# EasyEDA Pro project ProDocument_uMSX Rev.3.78实验_2024-03-19.epro, board uMSX Rev.3.78实验
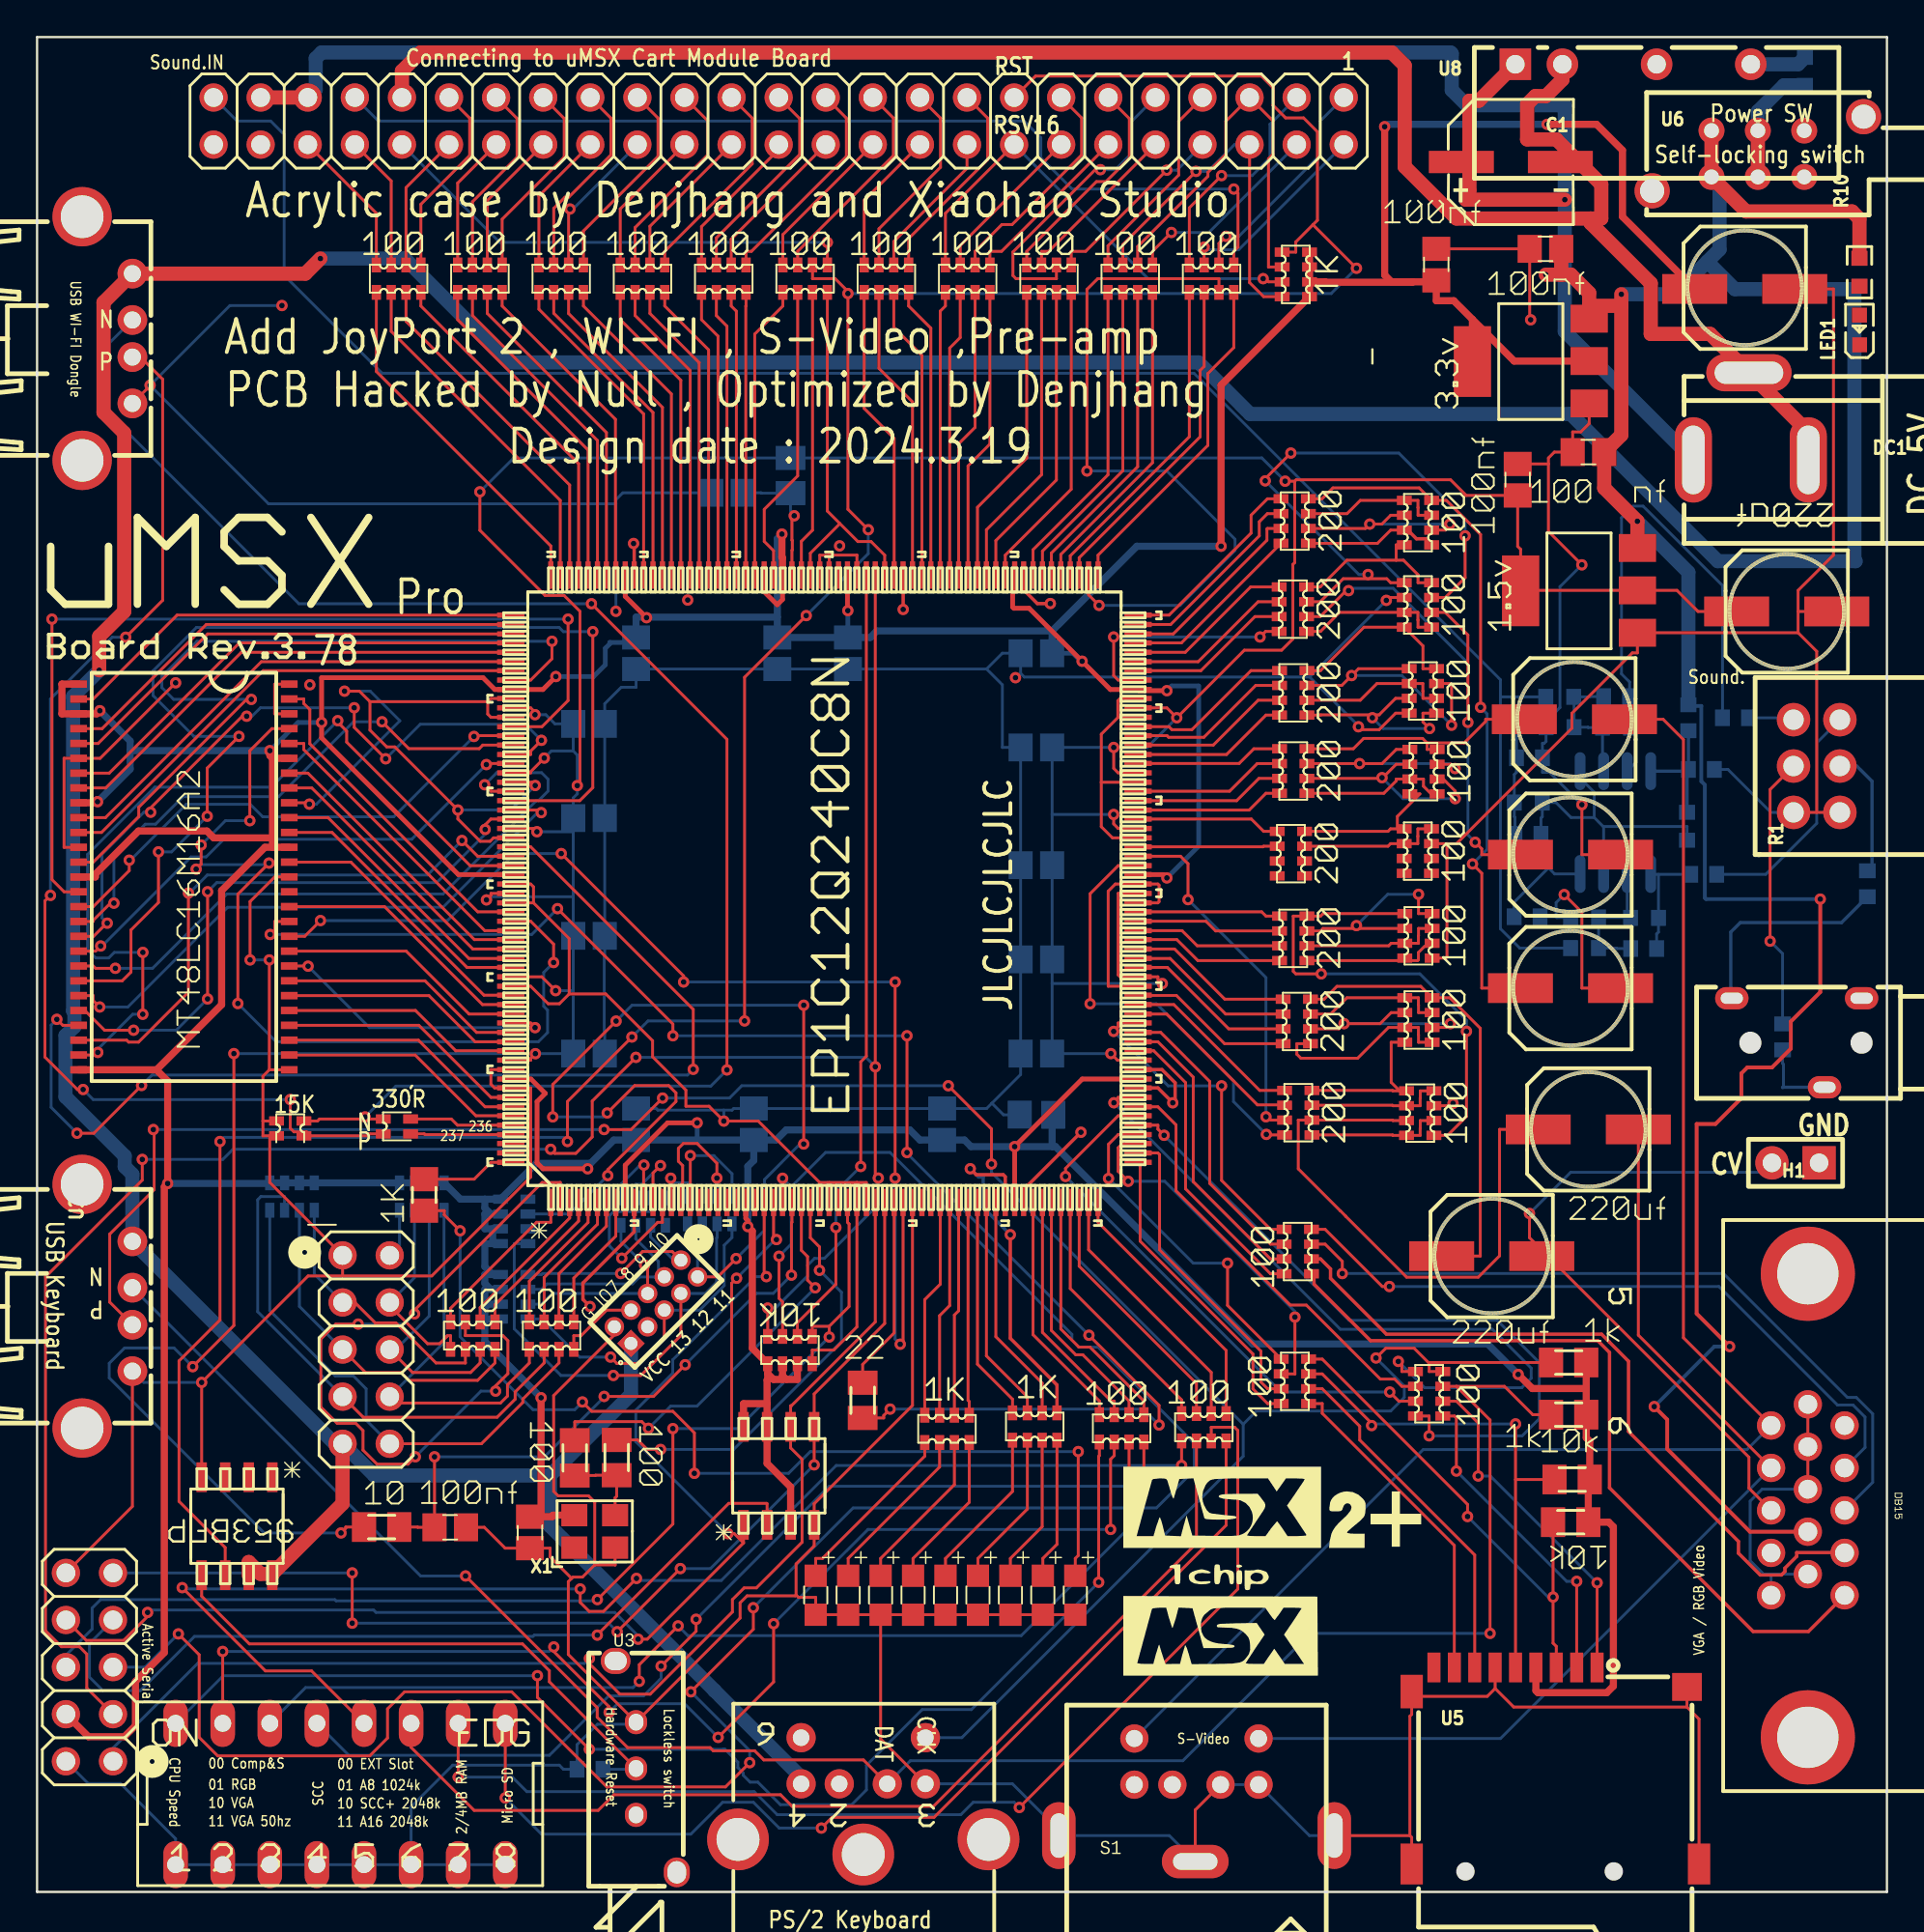
[diagram p0: board, top side]
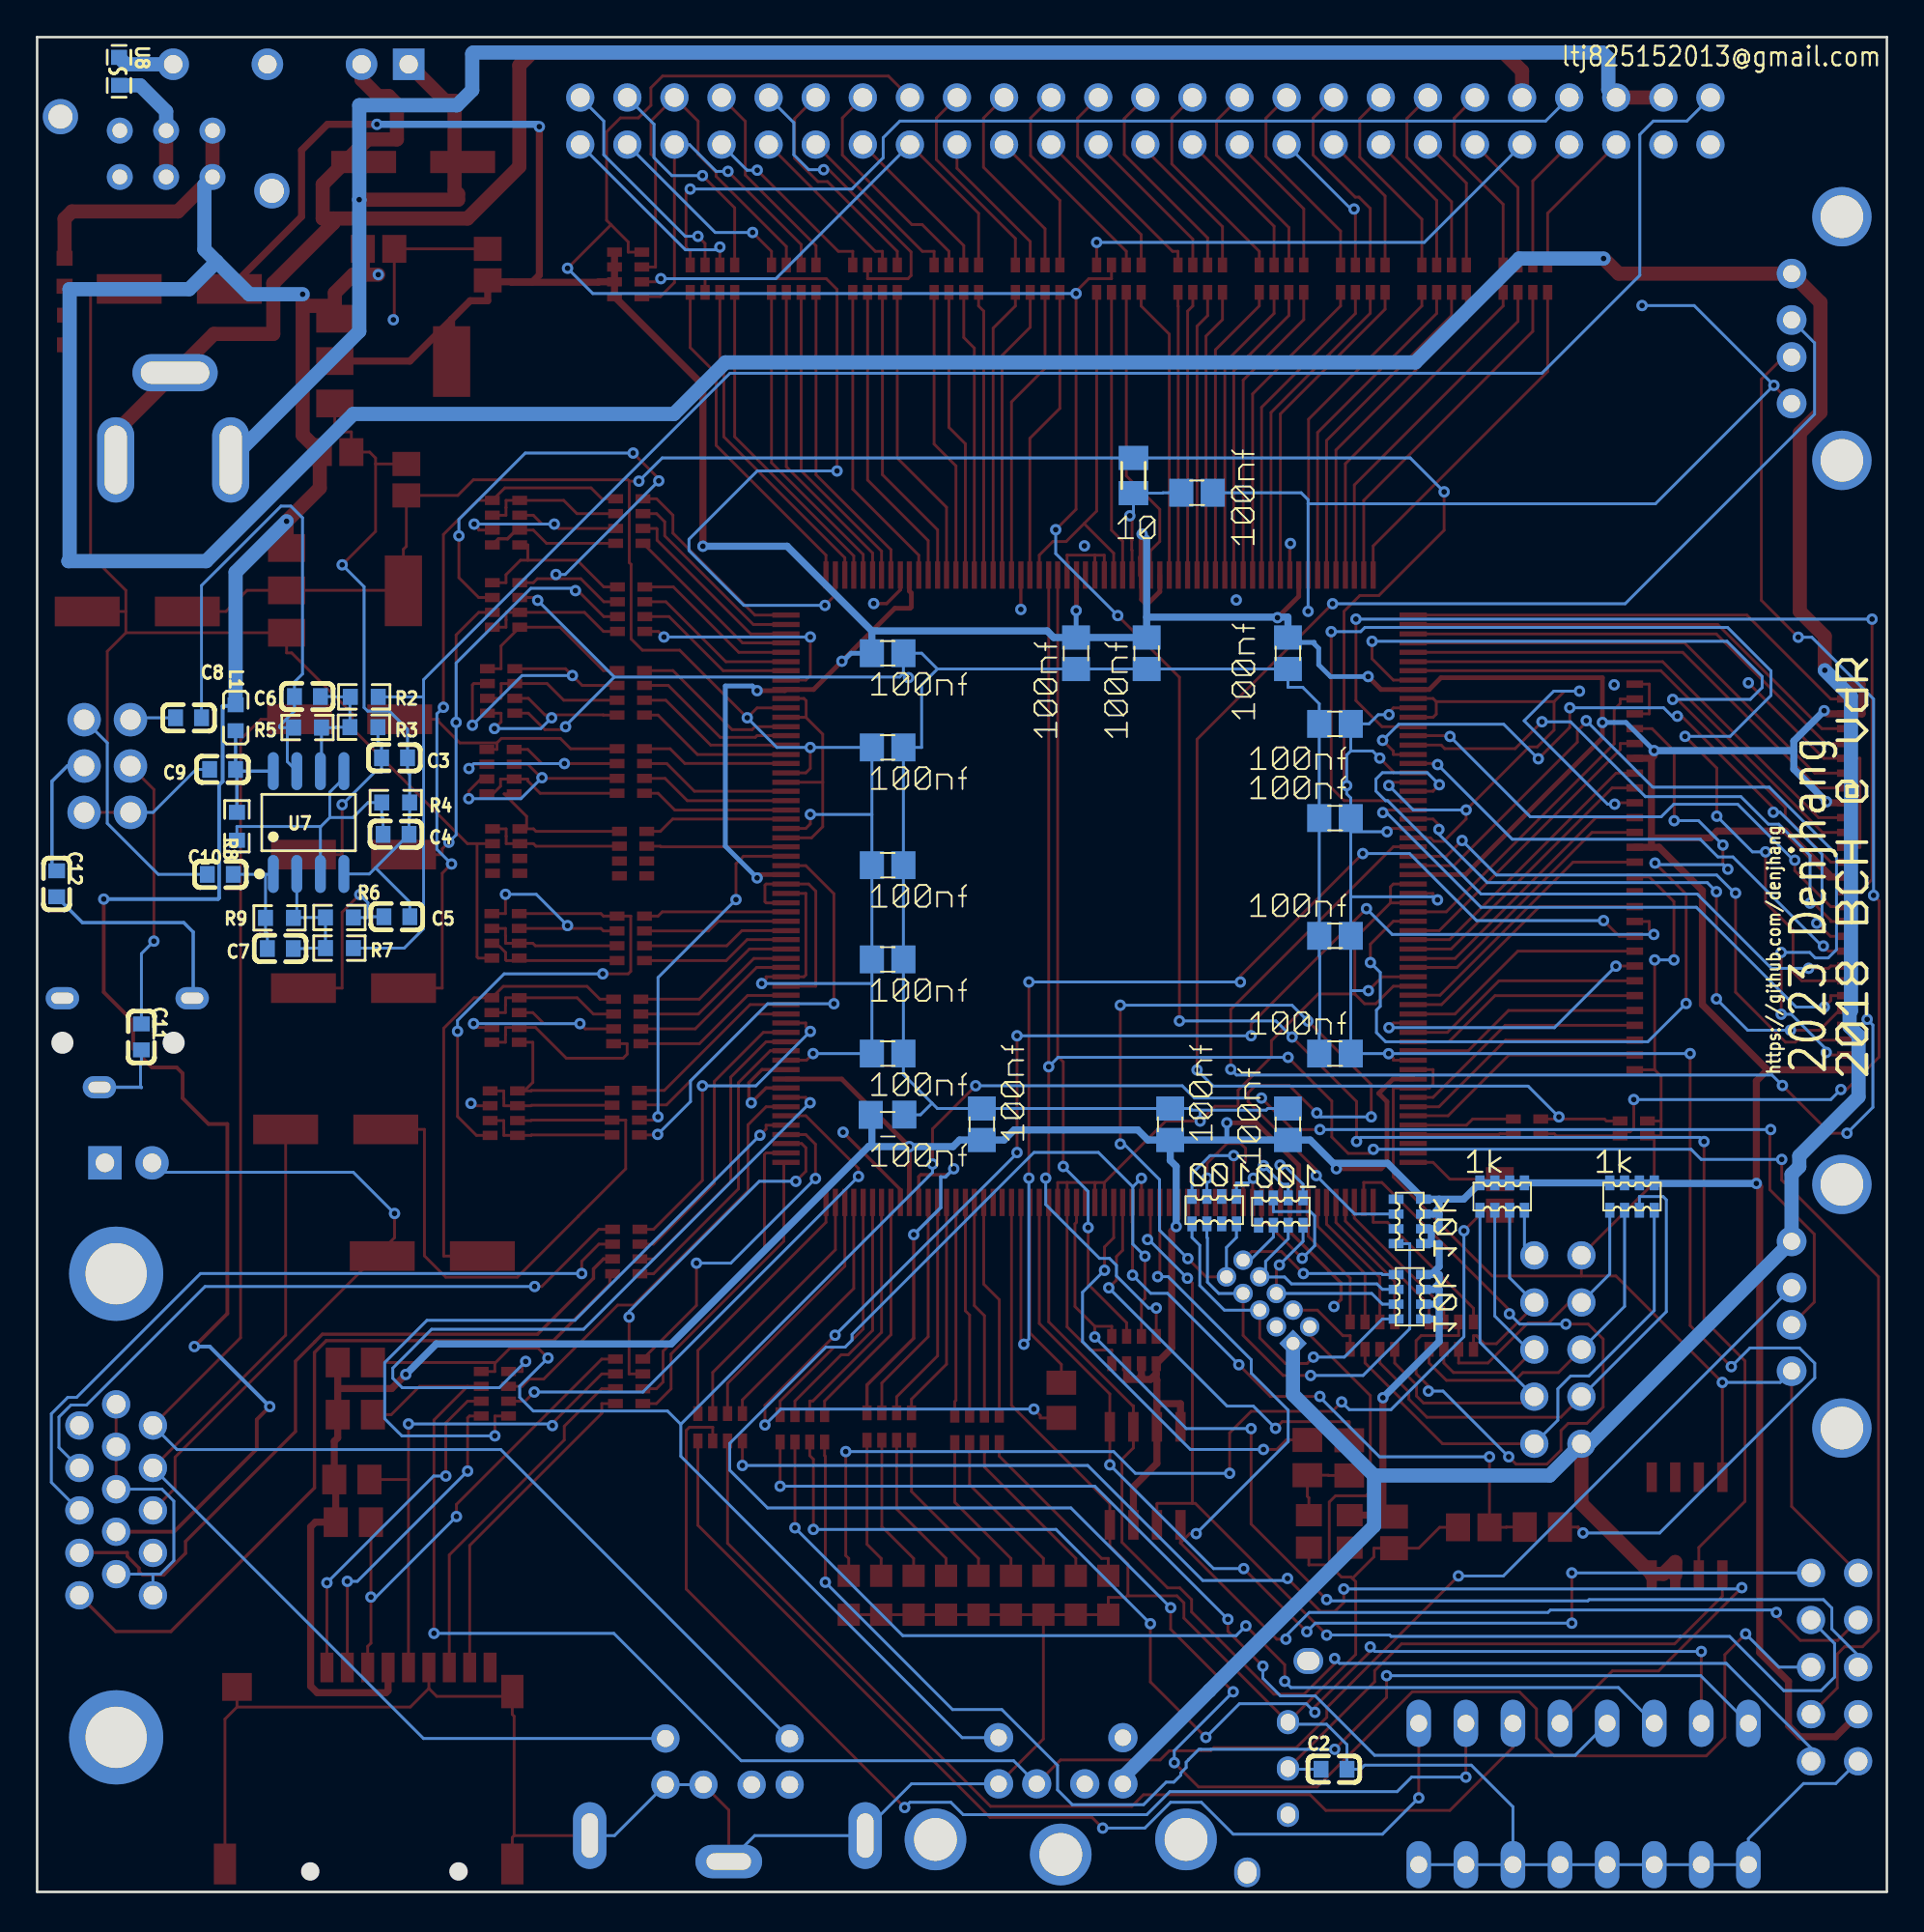
[diagram p1: board, bottom side, seen from below]

Outline 99.78 x 100.03 mm; copper layers: Top Layer, Bottom Layer. Coordinates in mm from the lower left corner of the outline.
Outline path: 0,100.03 99.78,100.03 99.78,0 0,0 0,100.03
Stack: Top Layer 0.0356mm - / Dielectric 1 0.32mm FR-4 er 4.8 / Bottom Layer 0.0356mm -

## Design rules (mm)
template: 自定义配置
spacing copperThickness1oz (default): track to track 0.127, other pairs 0.127 to 0.127
spacing copperThickness2oz: track to track 0.203, other pairs 0.152 to 0.3
track width 电源5V: min 0.203, default 0.762, max 1.016
track width copperThickness1oz (default): min 0.076, default 0.152, max 0.178
track width copperThickness2oz: min 0.203, default 0.254, max 2.54
track width 电源3V3: min 0.254, default 0.381, max 0.508
differential pair differentialPair (default): width min 0.127, default 0.254, max 2.54; gap min 0.152, default 0.152
via viaSize (default): diameter min 0.61, default 0.61, max 0.61; hole min 0.305, default 0.305, max 0.305
net $NET28 uses 电源3V3
net $NET275 uses 电源5V
net $NET279 uses 电源5V
net $NET135 uses 电源5V
net GND-IN uses 电源5V
net VCC-IN uses 电源5V

## Placement (name value [footprint] x y rotation side)
AUDIO1  PJ-320B  [AUDIO-TH_PJ-320B_C9900015649]  94.91 45.79 180 top
C1  220uF  [CAP-SMD_BD6.3-L6.6-W6.6-FD]  79.49 93.29 0 top
C2  2.2u  [C0603]  29.82 6.61 180 bottom
C3  1.5n  [C0603]  80.5 61.16 180 bottom
C4  10u  [C0603]  80.42 57.04 180 bottom
C5  1.5n  [C0603]  80.37 52.59 180 bottom
C6  120p  [C0603]  85.2 64.46 180 bottom
C7  120p  [C0603]  86.66 50.87 180 bottom
C8  4.7u  [C0603]  91.61 63.32 0 bottom
C9  100nF  [C0603]  89.77 60.53 180 bottom
C10  4.7u  [C0603]  89.9 54.87 0 bottom
C11  4.7u  [C0603]  94.15 46.11 90 bottom
C12  4.7u  [C0603]  98.72 54.37 90 bottom
DC1  DC005  [DC-IN-TH_DC005]  92.44 79.58 180 top
G IO1  HDR2X5-1.27  [HDR-TH_10P-P1.27-V-M-R2-C5-S1.27-1]  33.38 31.82 45 top
H1  HDR1X2  [HDR-TH_2P-P2.54-V-M-1]  94.85 39.32 180 top
L1  贴片磁珠0603-1/8W-70R-100MHZ(0.4R)  [L0603]  89.07 63.32 270 bottom
LED1  -  [LED_0603]  98.3 84.28 90 top
NOREF  -  [Pad_ie235]  67.21 45.74 0 top
NOREF#2  -  [Pad_ie205]  68.74 34.93 0 top
NOREF#3  -  [Pad_ie701]  31.22 71.02 0 top
NOREF#4  -  [Pad_ie2597]  26.47 33.29 90 top
NOREF#5  -  [Pad_ie395]  12.69 17.08 180 top
NOREF#6  -  [Pad_ie585]  25.55 40.84 0 top
NOREF#7  -  [Pad_ie418]  2.24 46.73 0 top
NOREF#8  -  [Pad_ie439]  2.24 63.53 0 top
NOREF#9  -  [Pad_ie422]  2.24 49.93 0 top
NOREF#10  -  [Pad_ie327]  68.37 57.19 0 top
NOREF#11  -  [Pad_ie57]  32.26 86.26 0 top
NOREF#12  -  [Pad_ie126]  61.73 24.32 0 top
NOREF#13  -  [Pad_ie100]  54.18 86.26 0 top
NOREF#14  -  [Pad_ie648]  57.23 37.18 0 top
NOREF#15  -  [Pad_e23]  10.01 1.47 0 top
NOREF#16  -  [Pad_ie614]  40.21 37.18 0 top
NOREF#17  -  [Pad_ie40]  24.28 86.26 0 top
NOREF#18  -  [Pad_ie87]  51.39 86.26 0 top
NOREF#19  -  [Pad_ie225]  67.29 41.62 0 top
NOREF#20  -  [Pad_ie187]  74.35 25.66 0 top
NOREF#21  -  [Pad_ie991]  19.02 26.71 0 top
NOREF#22  -  [Pad_ie150]  47.88 25.71 0 top
NOREF#23  -  [Pad_ie543]  25.55 61.85 0 top
NOREF#24  -  [Pad_ie310]  68.47 67.98 0 top
NOREF#25  -  [Pad_e24]  12.55 1.47 0 top
NOREF#26  -  [Pad_ie243]  68.49 50.22 0 top
NOREF#27  -  [Pad_e25]  15.09 1.47 0 top
NOREF#28  -  [Pad_ie45]  24.28 87.74 0 top
NOREF#29  -  [Pad_ie224]  67.29 42.42 0 top
NOREF#30  -  [Pad_ie415]  2.24 44.33 0 top
NOREF#31  -  [Pad_ie412]  83.72 84.84 0 top
NOREF#32  -  [Pad_ie518]  59.39 63.85 0 top
NOREF#33  -  [Pad_ie367]  80.01 55.94 0 top
NOREF#34  -  [Pad_ie2014]  35.88 37.5 0 top
NOREF#35  -  [Pad_ie338]  91.67 69.05 90 top
NOREF#36  -  [Pad_ie486]  59.39 47.85 0 top
NOREF#37  -  [Pad_ie110]  60.17 87.74 0 top
NOREF#38  -  [Pad_ie974]  37.46 94.23 0 top
NOREF#39  -  [Pad_ie621]  43.71 37.18 0 top
NOREF#40  -  [Pad_ie460]  13.6 50.73 0 top
NOREF#41  -  [Pad_ie702]  30.71 71.02 0 top
NOREF#42  -  [Pad_e10]  22.71 9.09 0 top
NOREF#43  -  [Pad_ie272]  75.49 65.17 0 top
NOREF#44  -  [Pad_e30]  25.25 1.47 0 top
NOREF#45  -  [Pad_ie932]  65.4 96.77 0 top
NOREF#46  -  [Pad_ie133]  58.1 25.74 0 top
NOREF#47  -  [Pad_ie334]  66.89 57.19 0 top
NOREF#48  -  [Pad_ie633]  49.71 37.18 0 top
NOREF#49  -  [Pad_ie230]  68.77 43.22 0 top
NOREF#50  -  [Pad_ie673]  45.21 71.02 0 top
NOREF#51  -  [Pad_ie142]  52.61 24.36 0 top
NOREF#52  -  [Pad_ie276]  74.01 64.37 0 top
NOREF#53  -  [Pad_ie678]  42.72 71.02 0 top
NOREF#54  -  [Pad_ie207]  73.77 45.82 0 top
NOREF#55  -  [Pad_ie1016]  21.15 36.76 0 top
NOREF#56  -  [Pad_ie1014]  14.95 36.76 0 top
NOREF#57  -  [Pad_ie250]  73.77 50.36 0 top
NOREF#58  -  [Pad_ie449]  13.6 59.54 0 top
NOREF#59  -  [Pad_ie425]  2.24 52.33 0 top
NOREF#60  -  [Pad_ie2468]  26.47 37.36 90 top
NOREF#61  -  [Pad_ie2596]  26.47 31.7 90 top
NOREF#62  -  [Pad_ie149]  48.68 25.71 0 top
NOREF#63  -  [Pad_ie1047]  30.62 45.21 0 top
NOREF#64  -  [Pad_ie577]  25.55 44.85 0 top
NOREF#65  -  [Pad_ie658]  52.73 71.02 0 top
NOREF#66  -  [Pad_ie612]  39.22 37.18 0 top
NOREF#67  -  [Pad_ie454]  13.6 55.53 0 top
NOREF#68  -  [Pad_ie669]  47.22 71.02 0 top
NOREF#69  -  [Pad_ie987]  19.02 31.79 0 top
NOREF#70  -  [Pad_ie358]  83.56 25.74 0 top
NOREF#71  -  [Pad_ie114]  64.55 87.74 0 top
NOREF#72  -  [Pad_ie94]  51.39 87.74 0 top
NOREF#73  -  [Pad_ie1224]  95.51 24 180 top
NOREF#74  -  [Pad_ie257]  75.21 55.73 0 top
NOREF#75  -  [Pad_ie941]  40 94.23 0 top
NOREF#76  -  [Pad_ie631]  48.72 37.18 0 top
NOREF#77  -  [Pad_ie19]  52.5 14.95 0 top
NOREF#78  -  [Pad_ie49]  27.87 87.74 0 top
NOREF#79  -  [Pad_ie575]  25.55 45.84 0 top
NOREF#80  -  [Pad_ie82]  44.61 87.74 0 top
NOREF#81  -  [Pad_ie216]  75.34 42.4 0 top
NOREF#82  -  [Pad_ie410]  86.32 70.19 0 top
NOREF#83  -  [Pad_ie1037]  54.75 61.72 0 top
NOREF#84  -  [Pad_ie359]  83.56 28.55 0 top
NOREF#85  -  [Pad_ie162]  24.7 30.74 0 top
NOREF#86  -  [Pad_ie471]  59.39 40.36 0 top
NOREF#87  -  [Pad_ie437]  2.24 61.93 0 top
NOREF#88  -  [Pad_ie356]  81.85 22.24 0 top
NOREF#89  -  [Pad_ie474]  59.39 41.86 0 top
NOREF#90  -  [Pad_ie1027]  32.31 40.55 0 top
NOREF#91  -  [Pad_ie1010]  12.55 38.24 0 top
NOREF#92  -  [Pad_ie166]  22.3 29.26 0 top
NOREF#93  -  [Pad_ie291]  73.75 75.04 0 top
NOREF#94  -  [Pad_ie546]  25.55 60.35 0 top
NOREF#95  -  [Pad_ie950]  40 96.77 0 top
NOREF#96  -  [Pad_ie2467]  26.47 35.76 90 top
NOREF#97  -  [Pad_ie220]  73.87 41.6 0 top
NOREF#98  -  [Pad_ie698]  32.71 71.02 0 top
NOREF#99  -  [Pad_ie650]  56.72 71.02 0 top
NOREF#100  -  [Pad_ie983]  4.09 14.66 270 top
NOREF#101  -  [Pad_ie538]  25.55 64.36 0 top
NOREF#102  -  [Pad_e11]  25.25 9.09 0 top
NOREF#103  -  [Pad_ie934]  67.94 94.23 0 top
NOREF#104  -  [Pad_ie81]  45.41 87.74 0 top
NOREF#105  -  [Pad_ie1056]  38.06 75.45 0 top
NOREF#106  -  [Pad_ie44]  23.48 87.74 0 top
NOREF#107  -  [Pad_ie4281]  21.44 19.66 90 top
NOREF#108  -  [Pad_ie155]  28.95 30.74 0 top
NOREF#109  -  [Pad_ie46]  25.08 87.74 0 top
NOREF#110  -  [Pad_ie566]  25.55 50.34 0 top
NOREF#111  -  [Pad_ie630]  48.21 37.18 0 top
NOREF#112  -  [Pad_ie37]  19.9 86.26 0 top
NOREF#113  -  [Pad_ie99]  53.38 86.26 0 top
NOREF#114  -  [Pad_ie436]  2.24 61.13 0 top
NOREF#115  -  [Pad_ie122]  64.14 25.8 0 top
NOREF#116  -  [Pad_ie287]  75.22 72.64 0 top
NOREF#117  -  [Pad_ie558]  25.55 54.35 0 top
NOREF#118  -  [Pad_ie1034]  43.74 67.65 0 top
NOREF#119  -  [Pad_ie459]  13.6 51.53 0 top
NOREF#120  -  [Pad_ie469]  59.39 39.34 0 top
NOREF#121  -  [Pad_ie685]  39.22 71.02 0 top
NOREF#122  -  [Pad_ie1252]  97.5 16 180 top
NOREF#123  -  [Pad_ie4245]  19.53 19.68 270 top
NOREF#124  -  [Pad_ie1025]  38.66 42.25 0 top
NOREF#125  -  [Pad_ie489]  59.39 49.35 0 top
NOREF#126  -  [Pad_ie42]  22.68 86.26 0 top
NOREF#127  -  [Pad_ie28]  45.5 17.05 0 top
NOREF#128  -  [Pad_ie2569]  25 36.56 90 top
NOREF#129  -  [Pad_ie129]  58.9 24.26 0 top
NOREF#130  -  [Pad_ie1039]  53.05 55.37 0 top
NOREF#131  -  [Pad_ie2670]  25 31.7 90 top
NOREF#132  -  [Pad_ie1963]  35.08 36.03 0 top
NOREF#133  -  [Pad_ie1983]  36.68 36.03 0 top
NOREF#134  -  [Pad_ie248]  73.77 51.96 0 top
NOREF#135  -  [Pad_ie32]  19.9 87.74 0 top
NOREF#136  -  [Pad_ie506]  59.39 57.86 0 top
NOREF#137  -  [Pad_ie652]  55.73 71.02 0 top
NOREF#138  -  [Pad_ie948]  45.08 96.77 0 top
NOREF#139  -  [Pad_ie556]  25.55 55.34 0 top
NOREF#140  -  [Pad_ie213]  75.25 46.62 0 top
NOREF#141  -  [Pad_ie430]  2.24 56.33 0 top
NOREF#142  -  [Pad_ie4273]  23.14 19.66 90 top
NOREF#143  -  [Pad_ie969]  24.76 94.23 0 top
NOREF#144  -  [Pad_e9]  20.17 9.09 0 top
NOREF#145  -  [Pad_ie3056]  20.15 41.68 90 top
NOREF#146  -  [Pad_ie1026]  38.66 40.55 0 top
NOREF#147  -  [Pad_ie509]  59.39 59.36 0 top
NOREF#148  -  [Pad_ie487]  59.39 48.36 0 top
NOREF#149  -  [Pad_ie1834]  31.49 35.95 0 top
NOREF#150  -  [Pad_ie988]  16.48 31.79 0 top
NOREF#151  -  [Pad_ie535]  25.55 65.86 0 top
NOREF#152  -  [Pad_e27]  20.17 1.47 0 top
NOREF#153  -  [Pad_ie31]  20.7 87.74 0 top
NOREF#154  -  [Pad_ie955]  27.3 96.77 0 top
NOREF#155  -  [Pad_ie693]  35.23 71.02 0 top
NOREF#156  -  [Pad_ie427]  2.24 53.93 0 top
NOREF#157  -  [Pad_ie48]  28.67 87.74 0 top
NOREF#158  -  [Pad_ie583]  25.55 41.86 0 top
NOREF#159  -  [Pad_ie2490]  26.47 34.96 90 top
NOREF#160  -  [Pad_ie589]  27.71 37.18 0 top
NOREF#161  -  [Pad_ie977]  1.55 12.12 270 top
NOREF#162  -  [Pad_ie279]  73.74 70.6 0 top
NOREF#163  -  [Pad_ie204]  68.74 34.14 0 top
NOREF#164  -  [Pad_ie58]  31.45 86.26 0 top
NOREF#165  -  [Pad_ie998]  41.21 8.32 270 top
NOREF#166  -  [Pad_ie2595]  26.47 32.49 90 top
NOREF#167  -  [Pad_ie692]  35.71 71.02 0 top
NOREF#168  -  [Pad_ie76]  41.03 87.74 0 top
NOREF#169  -  [Pad_ie170]  68.63 88.43 0 top
NOREF#170  -  [Pad_ie368]  85.41 55.94 0 top
NOREF#171  -  [Pad_ie552]  25.55 57.35 0 top
NOREF#172  -  [Pad_ie495]  59.39 52.35 0 top
NOREF#173  -  [Pad_ie294]  73.75 72.64 0 top
NOREF#174  -  [Pad_ie967]  19.68 94.23 0 top
NOREF#175  -  [Pad_ie2521]  25 34.96 90 top
NOREF#176  -  [Pad_ie392]  10.15 22.36 180 top
NOREF#177  -  [Pad_ie426]  2.24 53.13 0 top
NOREF#178  -  [Pad_ie435]  2.24 60.33 0 top
NOREF#179  -  [Pad_ie260]  73.74 55.73 0 top
NOREF#180  -  [Pad_ie1012]  13.35 36.76 0 top
NOREF#181  -  [Pad_ie996]  44.56 2.02 270 top
NOREF#182  -  [Pad_ie1052]  28.92 57.91 0 top
NOREF#183  -  [Pad_ie305]  67 69.58 0 top
NOREF#184  -  [Pad_ie503]  59.39 56.36 0 top
NOREF#185  -  [Pad_ie564]  25.55 51.36 0 top
NOREF#186  -  [Pad_ie2518]  25 37.36 90 top
NOREF#187  -  [Pad_ie1220]  97.5 25.15 270 top
NOREF#188  -  [Pad_ie4207]  26.59 18.54 0 top
NOREF#189  -  [Pad_ie649]  57.23 71.02 0 top
NOREF#190  -  [Pad_ie282]  73.74 68.2 0 top
NOREF#191  -  [Pad_ie574]  25.55 46.35 0 top
NOREF#192  -  [Pad_ie236]  67.21 46.54 0 top
NOREF#193  -  [Pad_ie937]  60.32 94.23 0 top
NOREF#194  -  [Pad_ie15]  45.5 14.95 0 top
NOREF#195  -  [Pad_ie953]  32.38 96.77 0 top
NOREF#196  -  [Pad_ie507]  59.39 58.34 0 top
NOREF#197  -  [Pad_ie245]  68.49 51.82 0 top
NOREF#198  -  [Pad_ie102]  55.78 86.26 0 top
NOREF#199  -  [Pad_ie47]  29.47 87.74 0 top
NOREF#200  -  [Pad_ie940]  52.7 94.23 0 top
NOREF#201  -  [Pad_ie78]  42.63 87.74 0 top
NOREF#202  -  [Pad_ie467]  13.6 45.13 0 top
NOREF#203  -  [Pad_ie500]  59.39 54.86 0 top
NOREF#204  -  [Pad_ie271]  75.49 65.96 0 top
NOREF#205  -  [Pad_ie309]  68.47 68.78 0 top
NOREF#206  -  [Pad_ie228]  68.77 41.62 0 top
NOREF#207  -  [Pad_ie20]  54.25 14.95 0 top
NOREF#208  -  [Pad_ie615]  40.72 37.18 0 top
NOREF#209  -  [Pad_ie609]  37.72 37.18 0 top
NOREF#210  -  [Pad_ie601]  33.73 37.18 0 top
NOREF#211  -  [Pad_ie407]  77.42 82.53 0 top
NOREF#212  -  [Pad_ie440]  2.24 64.33 0 top
NOREF#213  -  [Pad_ie431]  2.24 57.13 0 top
NOREF#214  -  [Pad_ie947]  47.62 96.77 0 top
NOREF#215  -  [Pad_ie972]  32.38 94.23 0 top
NOREF#216  -  [Pad_ie1854]  33.09 35.95 0 top
NOREF#217  -  [Pad_ie229]  68.77 42.42 0 top
NOREF#218  -  [Pad_ie961]  12.06 96.77 0 top
NOREF#219  -  [Pad_ie340]  89.41 86.45 90 top
NOREF#220  -  [Pad_ie942]  42.54 94.23 0 top
NOREF#221  -  [Pad_ie562]  25.55 52.35 0 top
NOREF#222  -  [Pad_ie450]  13.6 58.74 0 top
NOREF#223  -  [Pad_ie269]  75.52 60.81 0 top
NOREF#224  -  [Pad_ie532]  25.55 67.36 0 top
NOREF#225  -  [Pad_ie511]  59.39 60.35 0 top
NOREF#226  -  [Pad_ie132]  58.9 25.74 0 top
NOREF#227  -  [Pad_ie69]  37.44 86.26 0 top
NOREF#228  -  [Pad_ie1042]  53.05 50.29 0 top
NOREF#229  -  [Pad_ie613]  39.73 37.18 0 top
NOREF#230  -  [Pad_ie572]  25.55 47.34 0 top
NOREF#231  -  [Pad_ie550]  25.55 58.34 0 top
NOREF#232  -  [Pad_ie283]  75.22 68.2 0 top
NOREF#233  -  [Pad_ie660]  51.71 71.02 0 top
NOREF#234  -  [Pad_ie1041]  54.75 50.29 0 top
NOREF#235  -  [Pad_ie193]  68.58 27.13 0 top
NOREF#236  -  [Pad_ie600]  33.22 37.18 0 top
NOREF#237  -  [Pad_ie1038]  53.05 61.72 0 top
NOREF#238  -  [Pad_ie371]  75.47 88.61 0 top
NOREF#239  -  [Pad_ie112]  62.95 87.74 0 top
NOREF#240  -  [Pad_ie651]  56.21 71.02 0 top
NOREF#241  -  [Pad_ie482]  59.39 45.84 0 top
NOREF#242  -  [Pad_ie473]  59.39 41.35 0 top
NOREF#243  -  [Pad_ie981]  4.09 9.58 270 top
NOREF#244  -  [Pad_ie417]  2.24 45.93 0 top
NOREF#245  -  [Pad_ie479]  59.39 44.35 0 top
NOREF#246  -  [Pad_ie323]  68.49 61.65 0 top
NOREF#247  -  [Pad_ie1162]  93.53 20.58 180 top
NOREF#248  -  [Pad_ie706]  28.73 71.02 0 top
NOREF#249  -  [Pad_ie1024]  48.82 42.25 0 top
NOREF#250  -  [Pad_ie623]  44.73 37.18 0 top
NOREF#251  -  [Pad_ie125]  62.53 24.32 0 top
NOREF#252  -  [Pad_ie512]  59.39 60.86 0 top
NOREF#253  -  [Pad_ie13]  42 14.95 0 top
NOREF#254  -  [Pad_ie949]  42.54 96.77 0 top
NOREF#255  -  [Pad_ie292]  73.75 74.24 0 top
NOREF#256  -  [Pad_ie595]  30.71 37.18 0 top
NOREF#257  -  [Pad_ie38]  20.7 86.26 0 top
NOREF#258  -  [Pad_ie101]  54.98 86.26 0 top
NOREF#259  -  [Pad_ie232]  68.68 47.34 0 top
NOREF#260  -  [Pad_ie161]  23.9 30.74 0 top
NOREF#261  -  [Pad_ie152]  27.35 29.26 0 top
NOREF#262  -  [Pad_ie1011]  12.55 36.76 0 top
NOREF#263  -  [Pad_ie536]  25.55 65.35 0 top
NOREF#264  -  [Pad_ie464]  13.6 47.53 0 top
NOREF#265  -  [Pad_ie59]  31.45 87.74 0 top
NOREF#266  -  [Pad_ie344]  82.21 88.61 0 top
NOREF#267  -  [Pad_ie141]  53.41 24.36 0 top
NOREF#268  -  [Pad_ie369]  85.62 63.24 0 top
NOREF#269  -  [Pad_ie3133]  12.92 40.78 90 top
NOREF#270  -  [Pad_ie1022]  21.95 38.24 0 top
NOREF#271  -  [Pad_ie108]  58.56 87.74 0 top
NOREF#272  -  [Pad_ie432]  2.24 57.93 0 top
NOREF#273  -  [Pad_ie317]  67.02 64.26 0 top
NOREF#274  -  [Pad_e8]  17.63 9.09 0 top
NOREF#275  -  [Pad_ie307]  68.47 70.38 0 top
NOREF#276  -  [Pad_ie227]  68.77 40.82 0 top
NOREF#277  -  [Pad_ie980]  4.09 7.04 270 top
NOREF#278  -  [Pad_ie529]  25.55 68.86 0 top
NOREF#279  -  [Pad_ie364]  86.37 41.12 0 top
NOREF#280  -  [Pad_ie251]  75.25 50.36 0 top
NOREF#281  -  [Pad_ie667]  48.21 71.02 0 top
NOREF#282  -  [Pad_ie544]  25.55 61.34 0 top
NOREF#283  -  [Pad_ie107]  57.76 87.74 0 top
NOREF#284  -  [Pad_ie448]  13.6 60.33 0 top
NOREF#285  -  [Pad_ie255]  75.21 57.33 0 top
NOREF#286  -  [Pad_ie63]  38.24 87.74 0 top
NOREF#287  -  [Pad_ie534]  25.55 66.34 0 top
NOREF#288  -  [Pad_ie214]  75.25 45.82 0 top
NOREF#289  -  [Pad_ie524]  59.39 66.85 0 top
NOREF#290  -  [Pad_ie247]  73.77 52.76 0 top
NOREF#291  -  [Pad_ie39]  25.08 86.26 0 top
NOREF#292  -  [Pad_ie1159]  95.51 8.34 180 top
NOREF#293  -  [Pad_ie157]  27.35 30.74 0 top
NOREF#294  -  [Pad_ie646]  56.21 37.18 0 top
NOREF#295  -  [Pad_ie4204]  31.26 24.37 180 top
NOREF#296  -  [Pad_ie249]  73.77 51.16 0 top
NOREF#297  -  [Pad_ie365]  85.41 48.74 0 top
NOREF#298  -  [Pad_ie2619]  26.47 30.9 90 top
NOREF#299  -  [Pad_ie671]  46.23 71.02 0 top
NOREF#300  -  [Pad_ie153]  28.15 29.26 0 top
NOREF#301  -  [Pad_ie264]  74.04 60.81 0 top
NOREF#302  -  [Pad_ie656]  53.72 71.02 0 top
NOREF#303  -  [Pad_ie83]  44.61 86.26 0 top
NOREF#304  -  [Pad_ie1021]  21.15 38.24 0 top
NOREF#305  -  [Pad_ie156]  28.15 30.74 0 top
NOREF#306  -  [Pad_ie109]  59.36 87.74 0 top
NOREF#307  -  [Pad_ie280]  73.74 69.8 0 top
NOREF#308  -  [Pad_ie604]  35.23 37.18 0 top
NOREF#309  -  [Pad_ie295]  68.57 72.73 0 top
NOREF#310  -  [Pad_ie438]  2.24 62.73 0 top
NOREF#311  -  [Pad_ie1223]  93.53 22.87 180 top
NOREF#312  -  [Pad_ie244]  68.49 51.02 0 top
NOREF#313  -  [Pad_ie492]  59.39 50.85 0 top
NOREF#314  -  [Pad_ie221]  73.87 42.4 0 top
NOREF#315  -  [Pad_ie198]  67.11 28.74 0 top
NOREF#316  -  [Pad_ie191]  68.58 28.74 0 top
NOREF#317  -  [Pad_ie267]  75.52 59.22 0 top
NOREF#318  -  [Pad_ie519]  59.39 64.36 0 top
NOREF#319  -  [Pad_ie179]  41.81 29.96 90 top
NOREF#320  -  [Pad_ie268]  75.52 60.02 0 top
NOREF#321  -  [Pad_ie946]  50.16 96.77 0 top
NOREF#322  -  [Pad_ie603]  34.72 37.18 0 top
NOREF#323  -  [Pad_ie959]  17.14 96.77 0 top
NOREF#324  -  [Pad_ie411]  86.32 72.48 0 top
NOREF#325  -  [Pad_ie333]  66.89 56.39 0 top
NOREF#326  -  [Pad_ie331]  66.89 54.79 0 top
NOREF#327  -  [Pad_ie346]  82.83 77.65 0 top
NOREF#328  -  [Pad_ie682]  40.72 71.02 0 top
NOREF#329  -  [Pad_ie579]  25.55 43.84 0 top
NOREF#330  -  [Pad_ie290]  75.22 75.04 0 top
NOREF#331  -  [Pad_ie120]  62.53 25.8 0 top
NOREF#332  -  [Pad_ie936]  62.86 94.23 0 top
NOREF#333  -  [Pad_ie70]  38.24 86.26 0 top
NOREF#334  -  [Pad_ie455]  13.6 54.73 0 top
NOREF#335  -  [Pad_ie201]  67.26 34.14 0 top
NOREF#336  -  [Pad_ie239]  67.02 52.62 0 top
NOREF#337  -  [Pad_ie956]  24.76 96.77 0 top
NOREF#338  -  [Pad_ie605]  35.71 37.18 0 top
NOREF#339  -  [Pad_ie315]  67.02 65.86 0 top
NOREF#340  -  [Pad_ie177]  41.01 28.48 90 top
NOREF#341  -  [Pad_ie53]  28.67 86.26 0 top
NOREF#342  -  [Pad_ie159]  22.3 30.74 0 top
NOREF#343  -  [Pad_ie510]  59.39 59.84 0 top
NOREF#344  -  [Pad_ie396]  11.42 17.08 180 top
NOREF#345  -  [Pad_ie1225]  93.53 25.15 180 top
NOREF#346  -  [Pad_ie211]  75.25 48.22 0 top
NOREF#347  -  [Pad_ie571]  25.55 47.85 0 top
NOREF#348  -  [Pad_ie231]  68.68 48.14 0 top
NOREF#349  -  [Pad_ie680]  41.71 71.02 0 top
NOREF#350  -  [Pad_ie568]  25.55 49.35 0 top
NOREF#351  -  [Pad_ie586]  25.55 40.36 0 top
NOREF#352  -  [Pad_ie602]  34.21 37.18 0 top
NOREF#353  -  [Pad_ie428]  2.24 54.73 0 top
NOREF#354  -  [Pad_ie608]  37.21 37.18 0 top
NOREF#355  -  [Pad_ie393]  11.42 22.36 180 top
NOREF#356  -  [Pad_ie74]  40.23 86.26 0 top
NOREF#357  -  [Pad_ie697]  33.22 71.02 0 top
NOREF#358  -  [Pad_ie640]  53.21 37.18 0 top
NOREF#359  -  [Pad_ie304]  67 68.78 0 top
NOREF#360  -  [Pad_ie91]  48.99 87.74 0 top
NOREF#361  -  [Pad_ie644]  55.22 37.18 0 top
NOREF#362  -  [Pad_ie339]  94.81 86.45 90 top
NOREF#363  -  [Pad_e7]  15.09 9.09 0 top
NOREF#364  -  [Pad_ie530]  25.55 68.35 0 top
NOREF#365  -  [Pad_ie4208]  26.59 20.24 0 top
NOREF#366  -  [Pad_ie965]  14.6 94.23 0 top
NOREF#367  -  [Pad_ie441]  2.24 65.13 0 top
NOREF#368  -  [Pad_ie481]  59.39 45.36 0 top
NOREF#369  -  [Pad_ie68]  36.64 86.26 0 top
NOREF#370  -  [Pad_ie84]  45.41 86.26 0 top
NOREF#371  -  [Pad_ie2698]  25 32.49 90 top
NOREF#372  -  [Pad_ie1040]  54.75 55.37 0 top
NOREF#373  -  [Pad_ie979]  1.55 7.04 270 top
NOREF#374  -  [Pad_ie151]  26.55 29.26 0 top
NOREF#375  -  [Pad_ie634]  50.22 37.18 0 top
NOREF#376  -  [Pad_ie523]  59.39 66.34 0 top
NOREF#377  -  [Pad_ie398]  8.88 17.08 180 top
NOREF#378  -  [Pad_ie637]  51.71 37.18 0 top
NOREF#379  -  [Pad_ie596]  31.22 37.18 0 top
NOREF#380  -  [Pad_ie390]  44.53 25.56 0 top
NOREF#381  -  [Pad_ie1051]  30.62 57.91 0 top
NOREF#382  -  [Pad_ie635]  50.72 37.18 0 top
NOREF#383  -  [Pad_ie528]  59.39 68.86 0 top
NOREF#384  -  [Pad_ie420]  2.24 48.33 0 top
NOREF#385  -  [Pad_ie1020]  20.35 38.24 0 top
NOREF#386  -  [Pad_ie1253]  93.53 16 180 top
NOREF#387  -  [Pad_ie968]  22.22 94.23 0 top
NOREF#388  -  [Pad_ie462]  13.6 49.13 0 top
NOREF#389  -  [Pad_ie1045]  54.75 45.21 0 top
NOREF#390  -  [Pad_ie1255]  93.53 18.28 180 top
NOREF#391  -  [Pad_ie144]  48.68 24.23 0 top
NOREF#392  -  [Pad_ie196]  67.11 27.13 0 top
NOREF#393  -  [Pad_ie124]  63.33 24.32 0 top
NOREF#394  -  [Pad_ie957]  22.22 96.77 0 top
NOREF#395  -  [Pad_ie1007]  14.95 38.24 0 top
NOREF#396  -  [Pad_ie699]  32.21 71.02 0 top
NOREF#397  -  [Pad_ie22]  56 17.05 0 top
NOREF#398  -  [Pad_ie240]  67.02 51.82 0 top
NOREF#399  -  [Pad_ie501]  59.39 55.34 0 top
NOREF#400  -  [Pad_ie951]  37.46 96.77 0 top
NOREF#401  -  [Pad_ie559]  25.55 53.85 0 top
NOREF#402  -  [Pad_ie938]  57.78 94.23 0 top
NOREF#403  -  [Pad_ie286]  75.22 70.6 0 top
NOREF#404  -  [Pad_ie684]  39.73 71.02 0 top
NOREF#405  -  [Pad_ie445]  13.6 62.73 0 top
NOREF#406  -  [Pad_ie167]  68.63 86.03 0 top
NOREF#407  -  [Pad_ie499]  59.39 54.35 0 top
NOREF#408  -  [Pad_ie670]  46.71 71.02 0 top
NOREF#409  -  [Pad_ie414]  83.72 80.27 0 top
NOREF#410  -  [Pad_ie3132]  12.92 41.58 90 top
NOREF#411  -  [Pad_ie1058]  40.64 75.43 0 top
NOREF#412  -  [Pad_ie993]  16.48 24.17 0 top
NOREF#413  -  [Pad_ie672]  45.72 71.02 0 top
NOREF#414  -  [Pad_ie975]  1.55 17.2 270 top
NOREF#415  -  [Pad_ie176]  40.21 28.48 90 top
NOREF#416  -  [Pad_ie318]  67.02 63.46 0 top
NOREF#417  -  [Pad_e29]  22.71 1.47 0 top
NOREF#418  -  [Pad_ie491]  59.39 50.34 0 top
NOREF#419  -  [Pad_ie514]  59.39 61.85 0 top
NOREF#420  -  [Pad_ie27]  47.25 17.05 0 top
NOREF#421  -  [Pad_ie357]  81.66 25.74 0 top
NOREF#422  -  [Pad_ie409]  86.32 67.9 0 top
NOREF#423  -  [Pad_ie189]  74.35 27.26 0 top
NOREF#424  -  [Pad_ie25]  50.75 17.05 0 top
NOREF#425  -  [Pad_ie104]  59.36 86.26 0 top
NOREF#426  -  [Pad_ie254]  75.25 52.76 0 top
NOREF#427  -  [Pad_ie4240]  17.64 19.68 270 top
NOREF#428  -  [Pad_ie72]  41.83 86.26 0 top
NOREF#429  -  [Pad_ie1023]  48.82 40.55 0 top
NOREF#430  -  [Pad_ie3063]  18.67 41.68 90 top
NOREF#431  -  [Pad_ie554]  25.55 56.36 0 top
NOREF#432  -  [Pad_ie581]  25.55 42.85 0 top
NOREF#433  -  [Pad_ie643]  54.71 37.18 0 top
NOREF#434  -  [Pad_ie140]  54.21 24.36 0 top
NOREF#435  -  [Pad_ie1003]  45.86 5.83 270 top
NOREF#436  -  [Pad_ie361]  75.76 34.29 0 top
NOREF#437  -  [Pad_ie209]  73.77 47.42 0 top
NOREF#438  -  [Pad_ie147]  50.28 25.71 0 top
NOREF#439  -  [Pad_ie299]  67.1 75.13 0 top
NOREF#440  -  [Pad_ie990]  19.02 29.25 0 top
NOREF#441  -  [Pad_ie1219]  95.51 26.3 180 top
NOREF#442  -  [Pad_ie226]  67.29 40.82 0 top
NOREF#443  -  [Pad_ie645]  55.73 37.18 0 top
NOREF#444  -  [Pad_ie293]  73.75 73.44 0 top
NOREF#445  -  [Pad_ie377]  20.88 38.44 0 top
NOREF#446  -  [Pad_ie233]  68.68 46.54 0 top
NOREF#447  -  [Pad_ie192]  68.58 27.94 0 top
NOREF#448  -  [Pad_ie311]  68.49 63.46 0 top
NOREF#449  -  [Pad_ie242]  67.02 50.22 0 top
NOREF#450  -  [Pad_ie933]  67.94 96.77 0 top
NOREF#451  -  [Pad_ie517]  59.39 63.35 0 top
NOREF#452  -  [Pad_ie116]  63.75 86.26 0 top
NOREF#453  -  [Pad_ie423]  2.24 50.73 0 top
NOREF#454  -  [Pad_ie2541]  25 35.76 90 top
NOREF#455  -  [Pad_ie687]  38.23 71.02 0 top
NOREF#456  -  [Pad_ie691]  36.22 71.02 0 top
NOREF#457  -  [Pad_ie496]  59.39 52.85 0 top
NOREF#458  -  [Pad_ie1256]  95.51 19.42 180 top
NOREF#459  -  [Pad_ie113]  63.75 87.74 0 top
NOREF#460  -  [Pad_ie421]  2.24 49.13 0 top
NOREF#461  -  [Pad_ie661]  51.21 71.02 0 top
NOREF#462  -  [Pad_ie119]  61.73 25.8 0 top
NOREF#463  -  [Pad_ie175]  39.41 28.48 90 top
NOREF#464  -  [Pad_ie3064]  18.67 40.88 90 top
NOREF#465  -  [Pad_ie312]  68.49 64.26 0 top
NOREF#466  -  [Pad_ie21]  56 14.95 0 top
NOREF#467  -  [Pad_ie504]  59.39 56.84 0 top
NOREF#468  -  [Pad_ie263]  74.04 61.61 0 top
NOREF#469  -  [Pad_ie976]  1.55 14.66 90 top
NOREF#470  -  [Pad_ie985]  16.48 34.33 0 top
NOREF#471  -  [Pad_ie79]  47.01 87.74 0 top
NOREF#472  -  [Pad_ie989]  16.48 29.25 0 top
NOREF#473  -  [Pad_ie1002]  47.92 5.83 270 top
NOREF#474  -  [Pad_ie533]  25.55 66.85 0 top
NOREF#475  -  [Pad_ie24]  52.5 17.05 0 top
NOREF#476  -  [Pad_ie999]  41.21 5.83 270 top
NOREF#477  -  [Pad_ie1000]  43.27 5.83 270 top
NOREF#478  -  [Pad_ie522]  59.39 65.86 0 top
NOREF#479  -  [Pad_ie324]  68.49 60.85 0 top
NOREF#480  -  [Pad_ie95]  55.78 87.74 0 top
NOREF#481  -  [Pad_e1]  7.47 9.09 0 top
NOREF#482  -  [Pad_ie668]  47.73 71.02 0 top
NOREF#483  -  [Pad_ie622]  44.22 37.18 0 top
NOREF#484  -  [Pad_ie1054]  30.62 62.99 0 top
NOREF#485  -  [Pad_ie55]  33.86 86.26 0 top
NOREF#486  -  [Pad_ie625]  45.72 37.18 0 top
NOREF#487  -  [Pad_ie400]  40.64 19.8 0 top
NOREF#488  -  [Pad_ie41]  23.48 86.26 0 top
NOREF#489  -  [Pad_ie1985]  37.48 36.03 0 top
NOREF#490  -  [Pad_ie978]  1.55 9.58 270 top
NOREF#491  -  [Pad_ie71]  42.63 86.26 0 top
NOREF#492  -  [Pad_ie1057]  40.64 77.33 0 top
NOREF#493  -  [Pad_ie945]  50.16 94.23 0 top
NOREF#494  -  [Pad_ie105]  58.56 86.26 0 top
NOREF#495  -  [Pad_ie320]  67.02 60.05 0 top
NOREF#496  -  [Pad_ie90]  48.99 86.26 0 top
NOREF#497  -  [Pad_ie1043]  53 41.92 0 top
NOREF#498  -  [Pad_ie526]  59.39 67.84 0 top
NOREF#499  -  [Pad_ie468]  13.6 44.33 0 top
NOREF#500  -  [Pad_ie121]  63.33 25.8 0 top
NOREF#501  -  [Pad_ie261]  73.74 56.53 0 top
NOREF#502  -  [Pad_ie681]  41.22 71.02 0 top
NOREF#503  -  [Pad_ie452]  13.6 57.13 0 top
NOREF#504  -  [Pad_ie696]  33.73 71.02 0 top
NOREF#505  -  [Pad_ie1884]  33.09 37.43 0 top
NOREF#506  -  [Pad_ie130]  59.7 24.26 0 top
NOREF#507  -  [Pad_ie3126]  14.39 40.78 90 top
NOREF#508  -  [Pad_ie212]  75.25 47.42 0 top
NOREF#509  -  [Pad_ie354]  83.67 19.94 180 top
NOREF#510  -  [Pad_ie591]  28.73 37.18 0 top
NOREF#511  -  [Pad_ie557]  25.55 54.86 0 top
NOREF#512  -  [Pad_ie537]  25.55 64.84 0 top
NOREF#513  -  [Pad_ie963]  9.52 94.23 0 top
NOREF#514  -  [Pad_ie62]  33.86 87.74 0 top
NOREF#515  -  [Pad_ie1055]  36.36 75.45 0 top
NOREF#516  -  [Pad_ie278]  74.01 65.96 0 top
NOREF#517  -  [Pad_ie599]  32.71 37.18 0 top
NOREF#518  -  [Pad_ie96]  54.98 87.74 0 top
NOREF#519  -  [Pad_ie565]  25.55 50.85 0 top
NOREF#520  -  [Pad_ie128]  58.1 24.26 0 top
NOREF#521  -  [Pad_ie593]  29.72 37.18 0 top
NOREF#522  -  [Pad_ie984]  4.09 17.2 270 top
NOREF#523  -  [Pad_ie1015]  21.95 36.76 0 top
NOREF#524  -  [Pad_ie466]  13.6 45.93 0 top
NOREF#525  -  [Pad_ie2466]  26.47 36.56 90 top
NOREF#526  -  [Pad_ie960]  14.6 96.77 0 top
NOREF#527  -  [Pad_ie1013]  14.15 36.76 0 top
NOREF#528  -  [Pad_ie4180]  31.26 22.47 180 top
NOREF#529  -  [Pad_ie325]  68.49 60.05 0 top
NOREF#530  -  [Pad_ie683]  40.21 71.02 0 top
NOREF#531  -  [Pad_ie704]  29.72 71.02 0 top
NOREF#532  -  [Pad_ie306]  67 70.38 0 top
NOREF#533  -  [Pad_ie416]  2.24 45.13 0 top
NOREF#534  -  [Pad_ie16]  47.25 14.95 0 top
NOREF#535  -  [Pad_ie1049]  28.92 51.56 0 top
NOREF#536  -  [Pad_e22]  7.47 1.47 0 top
NOREF#537  -  [Pad_ie174]  67.16 86.03 0 top
NOREF#538  -  [Pad_ie219]  73.87 40.8 0 top
NOREF#539  -  [Pad_ie551]  25.55 57.86 0 top
NOREF#540  -  [Pad_ie958]  19.68 96.77 0 top
NOREF#541  -  [Pad_ie281]  73.74 69 0 top
NOREF#542  -  [Pad_ie164]  23.9 29.26 0 top
NOREF#543  -  [Pad_ie405]  40.64 25.08 0 top
NOREF#544  -  [Pad_ie563]  25.55 51.84 0 top
NOREF#545  -  [Pad_ie237]  67.21 47.34 0 top
NOREF#546  -  [Pad_ie1033]  43.74 65.95 0 top
NOREF#547  -  [Pad_ie457]  13.6 53.13 0 top
NOREF#548  -  [Pad_ie964]  12.06 94.23 0 top
NOREF#549  -  [Pad_ie115]  64.55 86.26 0 top
NOREF#550  -  [Pad_ie1009]  13.35 38.24 0 top
NOREF#551  -  [Pad_ie345]  84.53 77.65 0 top
NOREF#552  -  [Pad_ie413]  83.72 82.56 0 top
NOREF#553  -  [Pad_ie199]  67.26 35.73 0 top
NOREF#554  -  [Pad_ie180]  41.01 29.96 90 top
NOREF#555  -  [Pad_ie65]  36.64 87.74 0 top
NOREF#556  -  [Pad_ie171]  67.16 88.43 0 top
NOREF#557  -  [Pad_ie111]  62.15 87.74 0 top
NOREF#558  -  [Pad_ie616]  41.22 37.18 0 top
NOREF#559  -  [Pad_ie23]  54.25 17.05 0 top
NOREF#560  -  [Pad_ie442]  13.6 65.13 0 top
NOREF#561  -  [Pad_ie971]  29.84 94.23 0 top
NOREF#562  -  [Pad_ie319]  67.02 59.25 0 top
NOREF#563  -  [Pad_ie64]  37.44 87.74 0 top
NOREF#564  -  [Pad_ie289]  75.22 74.24 0 top
NOREF#565  -  [Pad_ie1017]  20.35 36.76 0 top
NOREF#566  -  [Pad_ie1855]  32.29 35.95 0 top
NOREF#567  -  [Pad_ie516]  59.39 62.84 0 top
NOREF#568  -  [Pad_ie301]  67.1 73.53 0 top
NOREF#569  -  [Pad_ie935]  65.4 94.23 0 top
NOREF#570  -  [Pad_ie531]  25.55 67.84 0 top
NOREF#571  -  [Pad_ie172]  67.16 87.63 0 top
NOREF#572  -  [Pad_ie470]  59.39 39.85 0 top
NOREF#573  -  [Pad_ie370]  80.22 63.24 0 top
NOREF#574  -  [Pad_ie569]  25.55 48.84 0 top
NOREF#575  -  [Pad_ie1035]  53.05 66.8 0 top
NOREF#576  -  [Pad_ie73]  41.03 86.26 0 top
NOREF#577  -  [Pad_ie502]  59.39 55.85 0 top
NOREF#578  -  [Pad_ie134]  57.3 25.74 0 top
NOREF#579  -  [Pad_ie146]  50.28 24.23 0 top
NOREF#580  -  [Pad_ie484]  59.39 46.86 0 top
NOREF#581  -  [Pad_ie584]  25.55 41.35 0 top
NOREF#582  -  [Pad_ie284]  75.22 69 0 top
NOREF#583  -  [Pad_ie182]  39.41 29.96 90 top
NOREF#584  -  [Pad_ie573]  25.55 46.86 0 top
NOREF#585  -  [Pad_e26]  17.63 1.47 0 top
NOREF#586  -  [Pad_ie1019]  19.55 38.24 0 top
NOREF#587  -  [Pad_ie944]  47.62 94.23 0 top
NOREF#588  -  [Pad_ie973]  34.92 94.23 0 top
NOREF#589  -  [Pad_ie493]  59.39 51.36 0 top
NOREF#590  -  [Pad_ie343]  80.51 88.61 0 top
NOREF#591  -  [Pad_ie97]  54.18 87.74 0 top
NOREF#592  -  [Pad_ie662]  50.72 71.02 0 top
NOREF#593  -  [Pad_ie1221]  97.5 22.87 180 top
NOREF#594  -  [Pad_ie443]  13.6 64.33 0 top
NOREF#595  -  [Pad_ie1018]  19.55 36.76 0 top
NOREF#596  -  [Pad_ie26]  49 17.05 0 top
NOREF#597  -  [Pad_ie106]  57.76 86.26 0 top
NOREF#598  -  [Pad_ie273]  75.49 64.37 0 top
NOREF#599  -  [Pad_ie262]  73.74 57.33 0 top
NOREF#600  -  [Pad_ie994]  19.02 24.17 0 top
NOREF#601  -  [Pad_ie80]  46.21 87.74 0 top
NOREF#602  -  [Pad_ie594]  30.23 37.18 0 top
NOREF#603  -  [Pad_ie676]  43.71 71.02 0 top
NOREF#604  -  [Pad_ie952]  34.92 96.77 0 top
NOREF#605  -  [Pad_ie51]  27.07 86.26 0 top
NOREF#606  -  [Pad_ie86]  47.01 86.26 0 top
NOREF#607  -  [Pad_ie143]  47.88 24.23 0 top
NOREF#608  -  [Pad_ie659]  52.22 71.02 0 top
NOREF#609  -  [Pad_ie118]  62.15 86.26 0 top
NOREF#610  -  [Pad_ie202]  67.26 33.34 0 top
NOREF#611  -  [Pad_ie1053]  28.92 62.99 0 top
NOREF#612  -  [Pad_ie1044]  54.81 41.91 0 top
NOREF#613  -  [Pad_ie653]  55.22 71.02 0 top
NOREF#614  -  [Pad_ie657]  53.21 71.02 0 top
NOREF#615  -  [Pad_ie85]  46.21 86.26 0 top
NOREF#616  -  [Pad_ie476]  59.39 42.85 0 top
NOREF#617  -  [Pad_ie373]  79.86 77.01 0 top
NOREF#618  -  [Pad_ie654]  54.71 71.02 0 top
NOREF#619  -  [Pad_ie203]  68.74 33.34 0 top
NOREF#620  -  [Pad_ie30]  42 17.05 0 top
NOREF#621  -  [Pad_ie2013]  36.68 37.5 0 top
NOREF#622  -  [Pad_ie465]  13.6 46.73 0 top
NOREF#623  -  [Pad_ie629]  47.73 37.18 0 top
NOREF#624  -  [Pad_ie389]  44.53 27.46 0 top
NOREF#625  -  [Pad_ie478]  59.39 43.84 0 top
NOREF#626  -  [Pad_ie4210]  29 22.46 0 top
NOREF#627  -  [Pad_ie995]  51.32 2.83 270 top
NOREF#628  -  [Pad_ie14]  43.75 14.95 0 top
NOREF#629  -  [Pad_ie355]  83.75 22.24 0 top
NOREF#630  -  [Pad_ie647]  56.72 37.18 0 top
NOREF#631  -  [Pad_ie372]  75.47 86.91 0 top
NOREF#632  -  [Pad_ie93]  50.59 87.74 0 top
NOREF#633  -  [Pad_ie285]  75.22 69.8 0 top
NOREF#634  -  [Pad_ie928]  55.24 96.77 0 top
NOREF#635  -  [Pad_ie461]  13.6 49.93 0 top
NOREF#636  -  [Pad_ie353]  81.77 19.94 0 top
NOREF#637  -  [Pad_ie617]  41.71 37.18 0 top
NOREF#638  -  [Pad_ie708]  27.71 71.02 0 top
NOREF#639  -  [Pad_ie675]  44.22 71.02 0 top
NOREF#640  -  [Pad_ie1826]  31.49 37.43 0 top
NOREF#641  -  [Pad_ie1955]  35.08 37.5 0 top
NOREF#642  -  [Pad_ie541]  25.55 62.84 0 top
NOREF#643  -  [Pad_ie181]  40.21 29.96 90 top
NOREF#644  -  [Pad_ie252]  75.25 51.16 0 top
NOREF#645  -  [Pad_ie567]  25.55 49.86 0 top
NOREF#646  -  [Pad_ie399]  41.92 19.8 0 top
NOREF#647  -  [Pad_ie472]  59.39 40.84 0 top
NOREF#648  -  [Pad_ie1048]  28.92 45.21 0 top
NOREF#649  -  [Pad_ie314]  68.49 65.86 0 top
NOREF#650  -  [Pad_ie36]  19.1 86.26 0 top
NOREF#651  -  [Pad_ie300]  67.1 74.33 0 top
NOREF#652  -  [Pad_ie92]  49.79 87.74 0 top
NOREF#653  -  [Pad_ie266]  74.04 59.22 0 top
NOREF#654  -  [Pad_ie611]  38.71 37.18 0 top
NOREF#655  -  [Pad_ie929]  57.78 96.77 0 top
NOREF#656  -  [Pad_ie253]  75.25 51.96 0 top
NOREF#657  -  [Pad_ie521]  59.39 65.35 0 top
NOREF#658  -  [Pad_ie185]  75.82 26.46 0 top
NOREF#659  -  [Pad_ie939]  55.24 94.23 0 top
NOREF#660  -  [Pad_ie270]  75.52 61.61 0 top
NOREF#661  -  [Pad_ie206]  68.74 35.73 0 top
NOREF#662  -  [Pad_ie1984]  35.88 36.03 0 top
NOREF#663  -  [Pad_ie374]  79.86 75.31 0 top
NOREF#664  -  [Pad_ie451]  13.6 57.93 0 top
NOREF#665  -  [Pad_ie515]  59.39 62.35 0 top
NOREF#666  -  [Pad_ie308]  68.47 69.58 0 top
NOREF#667  -  [Pad_ie137]  54.21 25.83 0 top
NOREF#668  -  [Pad_ie2650]  25 30.9 90 top
NOREF#669  -  [Pad_ie424]  2.24 51.53 0 top
NOREF#670  -  [Pad_ie560]  25.55 53.34 0 top
NOREF#671  -  [Pad_ie17]  49 14.95 0 top
NOREF#672  -  [Pad_ie178]  41.81 28.48 90 top
NOREF#673  -  [Pad_ie77]  41.83 87.74 0 top
NOREF#674  -  [Pad_ie401]  39.38 19.8 0 top
NOREF#675  -  [Pad_ie296]  68.57 73.53 0 top
NOREF#676  -  [Pad_ie561]  25.55 52.85 0 top
NOREF#677  -  [Pad_ie43]  22.68 87.74 0 top
NOREF#678  -  [Pad_ie190]  74.35 28.06 0 top
NOREF#679  -  [Pad_ie238]  67.21 48.14 0 top
NOREF#680  -  [Pad_ie302]  67.1 72.73 0 top
NOREF#681  -  [Pad_ie66]  35.84 87.74 0 top
NOREF#682  -  [Pad_ie223]  67.29 43.22 0 top
NOREF#683  -  [Pad_ie663]  50.22 71.02 0 top
NOREF#684  -  [Pad_ie624]  45.21 37.18 0 top
NOREF#685  -  [Pad_ie588]  25.55 39.34 0 top
NOREF#686  -  [Pad_ie1885]  32.29 37.43 0 top
NOREF#687  -  [Pad_ie67]  35.84 86.26 0 top
NOREF#688  -  [Pad_ie1222]  95.51 21.72 180 top
NOREF#689  -  [Pad_ie158]  26.55 30.74 0 top
NOREF#690  -  [Pad_ie218]  75.34 40.8 0 top
NOREF#691  -  [Pad_ie403]  38.11 25.08 0 top
NOREF#692  -  [Pad_ie195]  67.11 26.33 0 top
NOREF#693  -  [Pad_ie163]  24.7 29.26 0 top
NOREF#694  -  [Pad_ie592]  29.21 37.18 0 top
NOREF#695  -  [Pad_ie1218]  95.51 33.34 180 top
NOREF#696  -  [Pad_ie483]  59.39 46.35 0 top
NOREF#697  -  [Pad_ie208]  73.77 46.62 0 top
NOREF#698  -  [Pad_ie394]  12.69 22.36 180 top
NOREF#699  -  [Pad_ie488]  59.39 48.84 0 top
NOREF#700  -  [Pad_ie548]  25.55 59.36 0 top
NOREF#701  -  [Pad_ie576]  25.55 45.36 0 top
NOREF#702  -  [Pad_ie639]  52.73 37.18 0 top
NOREF#703  -  [Pad_ie117]  62.95 86.26 0 top
NOREF#704  -  [Pad_ie707]  28.22 71.02 0 top
NOREF#705  -  [Pad_ie458]  13.6 52.33 0 top
NOREF#706  -  [Pad_ie931]  62.86 96.77 0 top
NOREF#707  -  [Pad_ie954]  29.84 96.77 0 top
NOREF#708  -  [Pad_ie222]  73.87 43.2 0 top
NOREF#709  -  [Pad_ie527]  59.39 68.35 0 top
NOREF#710  -  [Pad_ie677]  43.23 71.02 0 top
NOREF#711  -  [Pad_ie508]  59.39 58.85 0 top
NOREF#712  -  [Pad_ie705]  29.21 71.02 0 top
NOREF#713  -  [Pad_ie580]  25.55 43.36 0 top
NOREF#714  -  [Pad_ie587]  25.55 39.85 0 top
NOREF#715  -  [Pad_ie525]  59.39 67.36 0 top
NOREF#716  -  [Pad_ie498]  59.39 53.85 0 top
NOREF#717  -  [Pad_ie406]  41.92 25.08 0 top
NOREF#718  -  [Pad_ie570]  25.55 48.36 0 top
NOREF#719  -  [Pad_ie362]  81.16 34.29 0 top
NOREF#720  -  [Pad_ie88]  50.59 86.26 0 top
NOREF#721  -  [Pad_ie3125]  14.39 41.58 90 top
NOREF#722  -  [Pad_ie138]  55.01 25.83 0 top
NOREF#723  -  [Pad_ie194]  68.58 26.33 0 top
NOREF#724  -  [Pad_ie246]  68.49 52.62 0 top
NOREF#725  -  [Pad_ie322]  67.02 61.65 0 top
NOREF#726  -  [Pad_ie297]  68.57 74.33 0 top
NOREF#727  -  [Pad_ie547]  25.55 59.84 0 top
NOREF#728  -  [Pad_ie29]  43.75 17.05 0 top
NOREF#729  -  [Pad_ie456]  13.6 53.93 0 top
NOREF#730  -  [Pad_ie555]  25.55 55.85 0 top
NOREF#731  -  [Pad_ie553]  25.55 56.84 0 top
NOREF#732  -  [Pad_ie366]  80.01 48.74 0 top
NOREF#733  -  [Pad_ie433]  2.24 58.74 0 top
NOREF#734  -  [Pad_ie52]  27.87 86.26 0 top
NOREF#735  -  [Pad_ie139]  55.01 24.36 0 top
NOREF#736  -  [Pad_ie620]  43.23 37.18 0 top
NOREF#737  -  [Pad_ie188]  74.35 26.46 0 top
NOREF#738  -  [Pad_ie215]  75.34 43.2 0 top
NOREF#739  -  [Pad_ie35]  18.3 86.26 0 top
NOREF#740  -  [Pad_ie1046]  53.05 45.21 0 top
NOREF#741  -  [Pad_ie363]  80.97 41.12 0 top
NOREF#742  -  [Pad_ie200]  67.26 34.93 0 top
NOREF#743  -  [Pad_ie3057]  20.15 40.88 90 top
NOREF#744  -  [Pad_ie582]  25.55 42.34 0 top
NOREF#745  -  [Pad_ie542]  25.55 62.35 0 top
NOREF#746  -  [Pad_ie332]  66.89 55.59 0 top
NOREF#747  -  [Pad_ie636]  51.21 37.18 0 top
NOREF#748  -  [Pad_ie103]  60.17 86.26 0 top
NOREF#749  -  [Pad_ie316]  67.02 65.06 0 top
NOREF#750  -  [Pad_ie275]  74.01 63.57 0 top
NOREF#751  -  [Pad_ie148]  49.48 25.71 0 top
NOREF#752  -  [Pad_ie391]  8.88 22.36 180 top
NOREF#753  -  [Pad_ie258]  75.21 54.93 0 top
NOREF#754  -  [Pad_ie513]  59.39 61.34 0 top
NOREF#755  -  [Pad_ie597]  31.72 37.18 0 top
NOREF#756  -  [Pad_ie926]  70.48 96.77 0 top
NOREF#757  -  [Pad_ie298]  68.57 75.13 0 top
NOREF#758  -  [Pad_ie217]  75.34 41.6 0 top
NOREF#759  -  [Pad_ie943]  45.08 94.23 0 top
NOREF#760  -  [Pad_ie607]  36.73 37.18 0 top
NOREF#761  -  [Pad_ie408]  80.02 70.17 0 top
NOREF#762  -  [Pad_ie4222]  29 24.36 0 top
NOREF#763  -  [Pad_ie925]  70.48 94.23 0 top
NOREF#764  -  [Pad_ie477]  59.39 43.36 0 top
NOREF#765  -  [Pad_ie34]  18.3 87.74 0 top
NOREF#766  -  [Pad_ie598]  32.21 37.18 0 top
NOREF#767  -  [Pad_ie402]  38.11 19.8 0 top
NOREF#768  -  [Pad_ie183]  75.82 28.06 0 top
NOREF#769  -  [Pad_ie997]  37.81 2.83 270 top
NOREF#770  -  [Pad_ie475]  59.39 42.34 0 top
NOREF#771  -  [Pad_ie674]  44.73 71.02 0 top
NOREF#772  -  [Pad_ie1031]  39.93 67.65 0 top
NOREF#773  -  [Pad_ie619]  42.72 37.18 0 top
NOREF#774  -  [Pad_ie695]  34.21 71.02 0 top
NOREF#775  -  [Pad_ie986]  19.02 34.33 0 top
NOREF#776  -  [Pad_ie679]  42.21 71.02 0 top
NOREF#777  -  [Pad_ie33]  19.1 87.74 0 top
NOREF#778  -  [Pad_ie690]  36.73 71.02 0 top
NOREF#779  -  [Pad_ie590]  28.22 37.18 0 top
NOREF#780  -  [Pad_ie136]  53.41 25.83 0 top
NOREF#781  -  [Pad_ie689]  37.21 71.02 0 top
NOREF#782  -  [Pad_ie429]  2.24 55.53 0 top
NOREF#783  -  [Pad_ie1050]  30.62 51.56 0 top
NOREF#784  -  [Pad_ie1001]  47.92 8.32 270 top
NOREF#785  -  [Pad_ie160]  23.1 30.74 0 top
NOREF#786  -  [Pad_ie397]  10.15 17.08 180 top
NOREF#787  -  [Pad_ie173]  67.16 86.83 0 top
NOREF#788  -  [Pad_ie1030]  32.31 67.65 0 top
NOREF#789  -  [Pad_ie539]  25.55 63.85 0 top
NOREF#790  -  [Pad_ie1878]  33.89 37.43 0 top
NOREF#791  -  [Pad_ie1029]  32.31 65.95 0 top
NOREF#792  -  [Pad_ie444]  13.6 63.53 0 top
NOREF#793  -  [Pad_ie135]  52.61 25.83 0 top
NOREF#794  -  [Pad_ie447]  13.6 61.13 0 top
NOREF#795  -  [Pad_ie168]  68.63 86.83 0 top
NOREF#796  -  [Pad_ie186]  75.82 25.66 0 top
NOREF#797  -  [Pad_ie446]  13.6 61.93 0 top
NOREF#798  -  [Pad_ie241]  67.02 51.02 0 top
NOREF#799  -  [Pad_ie627]  46.71 37.18 0 top
NOREF#800  -  [Pad_ie131]  59.7 25.74 0 top
NOREF#801  -  [Pad_ie992]  16.48 26.71 0 top
NOREF#802  -  [Pad_ie54]  29.47 86.26 0 top
NOREF#803  -  [Pad_ie256]  75.21 56.53 0 top
NOREF#804  -  [Pad_ie56]  33.06 86.26 0 top
NOREF#805  -  [Pad_ie329]  68.37 55.59 0 top
NOREF#806  -  [Pad_ie642]  54.23 37.18 0 top
NOREF#807  -  [Pad_e3]  10.01 9.09 0 top
NOREF#808  -  [Pad_ie277]  74.01 65.17 0 top
NOREF#809  -  [Pad_ie169]  68.63 87.63 0 top
NOREF#810  -  [Pad_ie618]  42.21 37.18 0 top
NOREF#811  -  [Pad_ie641]  53.72 37.18 0 top
NOREF#812  -  [Pad_ie197]  67.11 27.94 0 top
NOREF#813  -  [Pad_ie274]  75.49 63.57 0 top
NOREF#814  -  [Pad_ie337]  97.07 69.05 90 top
NOREF#815  -  [Pad_ie2647]  25 33.29 90 top
NOREF#816  -  [Pad_ie1856]  33.89 35.95 0 top
NOREF#817  -  [Pad_ie970]  27.3 94.23 0 top
NOREF#818  -  [Pad_ie463]  13.6 48.33 0 top
NOREF#819  -  [Pad_ie982]  4.09 12.12 270 top
NOREF#820  -  [Pad_ie664]  49.71 71.02 0 top
NOREF#821  -  [Pad_ie655]  54.23 71.02 0 top
NOREF#822  -  [Pad_ie321]  67.02 60.85 0 top
NOREF#823  -  [Pad_ie610]  38.23 37.18 0 top
NOREF#824  -  [Pad_ie265]  74.04 60.02 0 top
NOREF#825  -  [Pad_ie18]  50.75 14.95 0 top
NOREF#826  -  [Pad_ie165]  23.1 29.26 0 top
NOREF#827  -  [Pad_ie966]  17.14 94.23 0 top
NOREF#828  -  [Pad_ie490]  59.39 49.86 0 top
NOREF#829  -  [Pad_ie2007]  37.48 37.5 0 top
NOREF#830  -  [Pad_ie686]  38.71 71.02 0 top
NOREF#831  -  [Pad_e5]  12.55 9.09 0 top
NOREF#832  -  [Pad_ie480]  59.39 44.85 0 top
NOREF#833  -  [Pad_ie360]  81.66 28.55 0 top
NOREF#834  -  [Pad_ie927]  52.7 96.77 0 top
NOREF#835  -  [Pad_ie665]  49.23 71.02 0 top
NOREF#836  -  [Pad_ie98]  53.38 87.74 0 top
NOREF#837  -  [Pad_ie1036]  54.75 66.8 0 top
NOREF#838  -  [Pad_ie50]  27.07 87.74 0 top
NOREF#839  -  [Pad_ie288]  75.22 73.44 0 top
NOREF#840  -  [Pad_ie1028]  32.31 42.25 0 top
NOREF#841  -  [Pad_ie330]  68.37 54.79 0 top
NOREF#842  -  [Pad_ie540]  25.55 63.35 0 top
NOREF#843  -  [Pad_ie632]  49.23 37.18 0 top
NOREF#844  -  [Pad_ie145]  49.48 24.23 0 top
NOREF#845  -  [Pad_ie313]  68.49 65.06 0 top
NOREF#846  -  [Pad_ie549]  25.55 58.85 0 top
NOREF#847  -  [Pad_ie700]  31.72 71.02 0 top
NOREF#848  -  [Pad_ie497]  59.39 53.34 0 top
NOREF#849  -  [Pad_ie1161]  97.5 20.58 180 top
NOREF#850  -  [Pad_ie404]  39.38 25.08 0 top
NOREF#851  -  [Pad_ie259]  73.74 54.93 0 top
NOREF#852  -  [Pad_ie1251]  97.5 18.28 180 top
NOREF#853  -  [Pad_ie1032]  39.93 65.95 0 top
NOREF#854  -  [Pad_ie453]  13.6 56.33 0 top
NOREF#855  -  [Pad_ie930]  60.32 96.77 0 top
NOREF#856  -  [Pad_ie75]  40.23 87.74 0 top
NOREF#857  -  [Pad_ie638]  52.22 37.18 0 top
NOREF#858  -  [Pad_ie60]  32.26 87.74 0 top
NOREF#859  -  [Pad_ie123]  64.14 24.32 0 top
NOREF#860  -  [Pad_ie694]  34.72 71.02 0 top
NOREF#861  -  [Pad_ie378]  20.88 36.74 0 top
NOREF#862  -  [Pad_ie962]  9.52 96.77 0 top
NOREF#863  -  [Pad_ie1008]  14.15 38.24 0 top
NOREF#864  -  [Pad_ie666]  48.72 71.02 0 top
NOREF#865  -  [Pad_ie628]  47.22 37.18 0 top
NOREF#866  -  [Pad_ie578]  25.55 44.35 0 top
NOREF#867  -  [Pad_ie234]  68.68 45.74 0 top
NOREF#868  -  [Pad_ie1254]  95.51 17.14 180 top
NOREF#869  -  [Pad_ie184]  75.82 27.26 0 top
NOREF#870  -  [Pad_ie154]  28.95 29.26 0 top
NOREF#871  -  [Pad_ie328]  68.37 56.39 0 top
NOREF#872  -  [Pad_ie494]  59.39 51.84 0 top
NOREF#873  -  [Pad_ie127]  57.3 24.26 0 top
NOREF#874  -  [Pad_ie89]  49.79 86.26 0 top
NOREF#875  -  [Pad_ie210]  73.77 48.22 0 top
NOREF#876  -  [Pad_ie626]  46.23 37.18 0 top
NOREF#877  -  [Pad_ie688]  37.72 71.02 0 top
NOREF#878  -  [Pad_ie419]  2.24 47.53 0 top
NOREF#879  -  [Pad_ie606]  36.22 37.18 0 top
NOREF#880  -  [Pad_ie703]  30.23 71.02 0 top
NOREF#881  -  [Pad_ie326]  68.49 59.25 0 top
NOREF#882  -  [Pad_ie434]  2.24 59.54 0 top
NOREF#883  -  [Pad_ie520]  59.39 64.84 0 top
NOREF#884  -  [Pad_ie303]  67 67.98 0 top
NOREF#885  -  [Pad_ie505]  59.39 57.35 0 top
NOREF#886  -  [Pad_ie61]  33.06 87.74 0 top
NOREF#887  -  [Pad_ie485]  59.39 47.34 0 top
NOREF#888  -  [Pad_ie545]  25.55 60.86 0 top
R1  10kΩ  [RES-ADJ-TH_RK09712200MY]  95.99 60.72 90 top
R2  100K  [R0603]  82.13 64.45 180 bottom
R3  20K  [R0603]  82.15 62.81 180 bottom
R4  100K  [R0603]  80.43 58.75 180 bottom
R5  160K  [R0603]  85.19 62.79 180 bottom
R6  20K  [R0603]  83.47 52.55 180 bottom
R7  100K  [R0603]  83.47 50.9 180 bottom
R8  100K  [R0603]  89 57.47 90 bottom
R9  160K  [R0603]  86.7 52.53 180 bottom
R10  20K  [R0603]  98.3 87.35 270 top
S1  -  [S端子母座]  62.34 3.31 180 top
U1  USB-A1D122F-0N4N  [USB-A-TH_USB-A1D122F-0N4N]  3.78 83.77 270 top
U2  USB-A1D122F-0N4N  [USB-A-TH_USB-A1D122F-0N4N]  3.78 31.58 270 top
U3  PS-12E051  [SW-TH_PS-12E051XX]  32.86 6.76 270 top
U5  自弹TF卡座TFAA  [SIM-SMD_C9900015645]  81.89 6.8 0 top
U6  PS-22E05-S-Y  [SW-TH_PS-22E05]  92.82 93.74 0 top
U7  NE5532DR  [SOIC-8_L4.9-W3.9-P1.27-LS6.0-BL]  85.13 57.67 180 bottom
U8  -  [PWRM-TH_BXXXXS-3WR2]  86.09 98.56 0 top
U8#2  -  [F0603]  95.36 98.18 270 bottom
X1  25MHz  [OSC-SMD_4P-L3.2-W2.5-BL]  30.08 19.44 0 top

## Footprints (pads in the part's own frame, mm; a bottom-side part is the same pattern mirrored in y, then rotated)
AUDIO-TH_PJ-320B_C9900015649
  oval 1.8x1.2 hole 1.2x0.6: 2(-1.5,2.4) 3(-3.5,-2.4) 4(3.5,-2.4)
C0603
  rect 0.8x0.9 smd: 1(-0.7,0) 2(0.7,0)
CAP-SMD_BD6.3-L6.6-W6.6-FD
  rect 3.5x1.2 smd: 1(-2.67,0) 2(2.67,0)
DC-IN-TH_DC005
  oval 2x4.6 hole 1.2x3.7: 1(3.1,2.35) 2(-3.1,2.35)
  oval 4.6x2 hole 3.7x1.2: 3(0.1,-2.35)
F0603
  rect 0.806x0.864 smd: 1(-0.753,0) 2(0.753,0)
HDR-TH_2P-P2.54-V-M-1
  rect 1.8x1.8 hole 1: 1(-1.27,0)
  round 1.8 hole 1: 2(1.27,0)
HDR-TH_10P-P1.27-V-M-R2-C5-S1.27-1
  rect 1.05x1.05 hole 0.7: 1(-2.54,-0.635)
  round 1.05 hole 0.7: 2(-2.54,0.635) 3(-1.27,-0.635) 4(-1.27,0.635) 5(0,-0.635) 6(0,0.635) 7(1.27,-0.635) 8(1.27,0.635) 9(2.54,-0.635) 10(2.54,0.635)
L0603
  rect 0.8x0.864 smd: 1(-0.7,0) 2(0.7,0)
LED_0603
  rect 0.8x0.8 smd: 1(-0.851,-0.01) 2(0.75,-0.005)
OSC-SMD_4P-L3.2-W2.5-BL
  rect 1.4x1.2 smd: 1(-1.1,-0.875) 2(1.1,-0.875) 3(1.1,0.875) 4(-1.1,0.875)
Pad_e1
  oval 1.321x2.54 hole 0.914: 3(0,0)
Pad_e3
  oval 1.321x2.54 hole 0.914: 3(0,0)
Pad_e5
  oval 1.321x2.54 hole 0.914: 3(0,0)
Pad_e7
  oval 1.321x2.54 hole 0.914: 3(0,0)
Pad_e8
  oval 1.321x2.54 hole 0.914: 3(0,0)
Pad_e9
  oval 1.321x2.54 hole 0.914: 3(0,0)
Pad_e10
  oval 1.321x2.54 hole 0.914: 3(0,0)
Pad_e11
  oval 1.321x2.54 hole 0.914: 3(0,0)
Pad_e22
  oval 1.321x2.54 hole 0.914: 3(0,0)
Pad_e23
  oval 1.321x2.54 hole 0.914: 3(0,0)
Pad_e24
  oval 1.321x2.54 hole 0.914: 3(0,0)
Pad_e25
  oval 1.321x2.54 hole 0.914: 3(0,0)
Pad_e26
  oval 1.321x2.54 hole 0.914: 3(0,0)
Pad_e27
  oval 1.321x2.54 hole 0.914: 3(0,0)
Pad_e29
  oval 1.321x2.54 hole 0.914: 3(0,0)
Pad_e30
  oval 1.321x2.54 hole 0.914: 3(0,0)
Pad_ie13
  rect 1.199x1.199 smd: 1(0,0)
Pad_ie14
  rect 1.199x1.199 smd: 1(0,0)
Pad_ie15
  rect 1.199x1.199 smd: 1(0,0)
Pad_ie16
  rect 1.199x1.199 smd: 1(0,0)
Pad_ie17
  rect 1.199x1.199 smd: 1(0,0)
Pad_ie18
  rect 1.199x1.199 smd: 1(0,0)
Pad_ie19
  rect 1.199x1.199 smd: 1(0,0)
Pad_ie20
  rect 1.199x1.199 smd: 1(0,0)
Pad_ie21
  rect 1.199x1.199 smd: 1(0,0)
Pad_ie22
  rect 1.199x1.199 smd: 1(0,0)
Pad_ie23
  rect 1.199x1.199 smd: 1(0,0)
Pad_ie24
  rect 1.199x1.199 smd: 1(0,0)
Pad_ie25
  rect 1.199x1.199 smd: 1(0,0)
Pad_ie26
  rect 1.199x1.199 smd: 1(0,0)
Pad_ie27
  rect 1.199x1.199 smd: 1(0,0)
Pad_ie28
  rect 1.199x1.199 smd: 1(0,0)
Pad_ie29
  rect 1.199x1.199 smd: 1(0,0)
Pad_ie30
  rect 1.199x1.199 smd: 1(0,0)
Pad_ie31
  rect 0.5x0.8 smd: 1(0,0)
Pad_ie32
  rect 0.5x0.8 smd: 1(0,0)
Pad_ie33
  rect 0.5x0.8 smd: 1(0,0)
Pad_ie34
  rect 0.5x0.8 smd: 1(0,0)
Pad_ie35
  rect 0.5x0.8 smd: 1(0,0)
Pad_ie36
  rect 0.5x0.8 smd: 1(0,0)
Pad_ie37
  rect 0.5x0.8 smd: 1(0,0)
Pad_ie38
  rect 0.5x0.8 smd: 1(0,0)
Pad_ie39
  rect 0.5x0.8 smd: 1(0,0)
Pad_ie40
  rect 0.5x0.8 smd: 1(0,0)
Pad_ie41
  rect 0.5x0.8 smd: 1(0,0)
Pad_ie42
  rect 0.5x0.8 smd: 1(0,0)
Pad_ie43
  rect 0.5x0.8 smd: 1(0,0)
Pad_ie44
  rect 0.5x0.8 smd: 1(0,0)
Pad_ie45
  rect 0.5x0.8 smd: 1(0,0)
Pad_ie46
  rect 0.5x0.8 smd: 1(0,0)
Pad_ie47
  rect 0.5x0.8 smd: 1(0,0)
Pad_ie48
  rect 0.5x0.8 smd: 1(0,0)
Pad_ie49
  rect 0.5x0.8 smd: 1(0,0)
Pad_ie50
  rect 0.5x0.8 smd: 1(0,0)
Pad_ie51
  rect 0.5x0.8 smd: 1(0,0)
Pad_ie52
  rect 0.5x0.8 smd: 1(0,0)
Pad_ie53
  rect 0.5x0.8 smd: 1(0,0)
Pad_ie54
  rect 0.5x0.8 smd: 1(0,0)
Pad_ie55
  rect 0.5x0.8 smd: 1(0,0)
Pad_ie56
  rect 0.5x0.8 smd: 1(0,0)
Pad_ie57
  rect 0.5x0.8 smd: 1(0,0)
Pad_ie58
  rect 0.5x0.8 smd: 1(0,0)
Pad_ie59
  rect 0.5x0.8 smd: 1(0,0)
Pad_ie60
  rect 0.5x0.8 smd: 1(0,0)
Pad_ie61
  rect 0.5x0.8 smd: 1(0,0)
Pad_ie62
  rect 0.5x0.8 smd: 1(0,0)
Pad_ie63
  rect 0.5x0.8 smd: 1(0,0)
Pad_ie64
  rect 0.5x0.8 smd: 1(0,0)
Pad_ie65
  rect 0.5x0.8 smd: 1(0,0)
Pad_ie66
  rect 0.5x0.8 smd: 1(0,0)
Pad_ie67
  rect 0.5x0.8 smd: 1(0,0)
Pad_ie68
  rect 0.5x0.8 smd: 1(0,0)
Pad_ie69
  rect 0.5x0.8 smd: 1(0,0)
Pad_ie70
  rect 0.5x0.8 smd: 1(0,0)
Pad_ie71
  rect 0.5x0.8 smd: 1(0,0)
Pad_ie72
  rect 0.5x0.8 smd: 1(0,0)
Pad_ie73
  rect 0.5x0.8 smd: 1(0,0)
Pad_ie74
  rect 0.5x0.8 smd: 1(0,0)
Pad_ie75
  rect 0.5x0.8 smd: 1(0,0)
Pad_ie76
  rect 0.5x0.8 smd: 1(0,0)
Pad_ie77
  rect 0.5x0.8 smd: 1(0,0)
Pad_ie78
  rect 0.5x0.8 smd: 1(0,0)
Pad_ie79
  rect 0.5x0.8 smd: 1(0,0)
Pad_ie80
  rect 0.5x0.8 smd: 1(0,0)
Pad_ie81
  rect 0.5x0.8 smd: 1(0,0)
Pad_ie82
  rect 0.5x0.8 smd: 1(0,0)
Pad_ie83
  rect 0.5x0.8 smd: 1(0,0)
Pad_ie84
  rect 0.5x0.8 smd: 1(0,0)
Pad_ie85
  rect 0.5x0.8 smd: 1(0,0)
Pad_ie86
  rect 0.5x0.8 smd: 1(0,0)
Pad_ie87
  rect 0.5x0.8 smd: 1(0,0)
Pad_ie88
  rect 0.5x0.8 smd: 1(0,0)
Pad_ie89
  rect 0.5x0.8 smd: 1(0,0)
Pad_ie90
  rect 0.5x0.8 smd: 1(0,0)
Pad_ie91
  rect 0.5x0.8 smd: 1(0,0)
Pad_ie92
  rect 0.5x0.8 smd: 1(0,0)
Pad_ie93
  rect 0.5x0.8 smd: 1(0,0)
Pad_ie94
  rect 0.5x0.8 smd: 1(0,0)
Pad_ie95
  rect 0.5x0.8 smd: 1(0,0)
Pad_ie96
  rect 0.5x0.8 smd: 1(0,0)
Pad_ie97
  rect 0.5x0.8 smd: 1(0,0)
Pad_ie98
  rect 0.5x0.8 smd: 1(0,0)
Pad_ie99
  rect 0.5x0.8 smd: 1(0,0)
Pad_ie100
  rect 0.5x0.8 smd: 1(0,0)
Pad_ie101
  rect 0.5x0.8 smd: 1(0,0)
Pad_ie102
  rect 0.5x0.8 smd: 1(0,0)
Pad_ie103
  rect 0.5x0.8 smd: 1(0,0)
Pad_ie104
  rect 0.5x0.8 smd: 1(0,0)
Pad_ie105
  rect 0.5x0.8 smd: 1(0,0)
Pad_ie106
  rect 0.5x0.8 smd: 1(0,0)
Pad_ie107
  rect 0.5x0.8 smd: 1(0,0)
Pad_ie108
  rect 0.5x0.8 smd: 1(0,0)
Pad_ie109
  rect 0.5x0.8 smd: 1(0,0)
Pad_ie110
  rect 0.5x0.8 smd: 1(0,0)
Pad_ie111
  rect 0.5x0.8 smd: 1(0,0)
Pad_ie112
  rect 0.5x0.8 smd: 1(0,0)
Pad_ie113
  rect 0.5x0.8 smd: 1(0,0)
Pad_ie114
  rect 0.5x0.8 smd: 1(0,0)
Pad_ie115
  rect 0.5x0.8 smd: 1(0,0)
Pad_ie116
  rect 0.5x0.8 smd: 1(0,0)
Pad_ie117
  rect 0.5x0.8 smd: 1(0,0)
Pad_ie118
  rect 0.5x0.8 smd: 1(0,0)
Pad_ie119
  rect 0.5x0.8 smd: 1(0,0)
Pad_ie120
  rect 0.5x0.8 smd: 1(0,0)
Pad_ie121
  rect 0.5x0.8 smd: 1(0,0)
Pad_ie122
  rect 0.5x0.8 smd: 1(0,0)
Pad_ie123
  rect 0.5x0.8 smd: 1(0,0)
Pad_ie124
  rect 0.5x0.8 smd: 1(0,0)
Pad_ie125
  rect 0.5x0.8 smd: 1(0,0)
Pad_ie126
  rect 0.5x0.8 smd: 1(0,0)
Pad_ie127
  rect 0.5x0.8 smd: 1(0,0)
Pad_ie128
  rect 0.5x0.8 smd: 1(0,0)
Pad_ie129
  rect 0.5x0.8 smd: 1(0,0)
Pad_ie130
  rect 0.5x0.8 smd: 1(0,0)
Pad_ie131
  rect 0.5x0.8 smd: 1(0,0)
Pad_ie132
  rect 0.5x0.8 smd: 1(0,0)
Pad_ie133
  rect 0.5x0.8 smd: 1(0,0)
Pad_ie134
  rect 0.5x0.8 smd: 1(0,0)
Pad_ie135
  rect 0.5x0.8 smd: 1(0,0)
Pad_ie136
  rect 0.5x0.8 smd: 1(0,0)
Pad_ie137
  rect 0.5x0.8 smd: 1(0,0)
Pad_ie138
  rect 0.5x0.8 smd: 1(0,0)
Pad_ie139
  rect 0.5x0.8 smd: 1(0,0)
Pad_ie140
  rect 0.5x0.8 smd: 1(0,0)
Pad_ie141
  rect 0.5x0.8 smd: 1(0,0)
Pad_ie142
  rect 0.5x0.8 smd: 1(0,0)
Pad_ie143
  rect 0.5x0.8 smd: 1(0,0)
Pad_ie144
  rect 0.5x0.8 smd: 1(0,0)
Pad_ie145
  rect 0.5x0.8 smd: 1(0,0)
Pad_ie146
  rect 0.5x0.8 smd: 1(0,0)
Pad_ie147
  rect 0.5x0.8 smd: 1(0,0)
Pad_ie148
  rect 0.5x0.8 smd: 1(0,0)
Pad_ie149
  rect 0.5x0.8 smd: 1(0,0)
Pad_ie150
  rect 0.5x0.8 smd: 1(0,0)
Pad_ie151
  rect 0.5x0.8 smd: 1(0,0)
Pad_ie152
  rect 0.5x0.8 smd: 1(0,0)
Pad_ie153
  rect 0.5x0.8 smd: 1(0,0)
Pad_ie154
  rect 0.5x0.8 smd: 1(0,0)
Pad_ie155
  rect 0.5x0.8 smd: 1(0,0)
Pad_ie156
  rect 0.5x0.8 smd: 1(0,0)
Pad_ie157
  rect 0.5x0.8 smd: 1(0,0)
Pad_ie158
  rect 0.5x0.8 smd: 1(0,0)
Pad_ie159
  rect 0.5x0.8 smd: 1(0,0)
Pad_ie160
  rect 0.5x0.8 smd: 1(0,0)
Pad_ie161
  rect 0.5x0.8 smd: 1(0,0)
Pad_ie162
  rect 0.5x0.8 smd: 1(0,0)
Pad_ie163
  rect 0.5x0.8 smd: 1(0,0)
